# Altium schematic sheet 0240_GPU GDDR DEVICE DE.SchDoc
size 848 x 558 mm
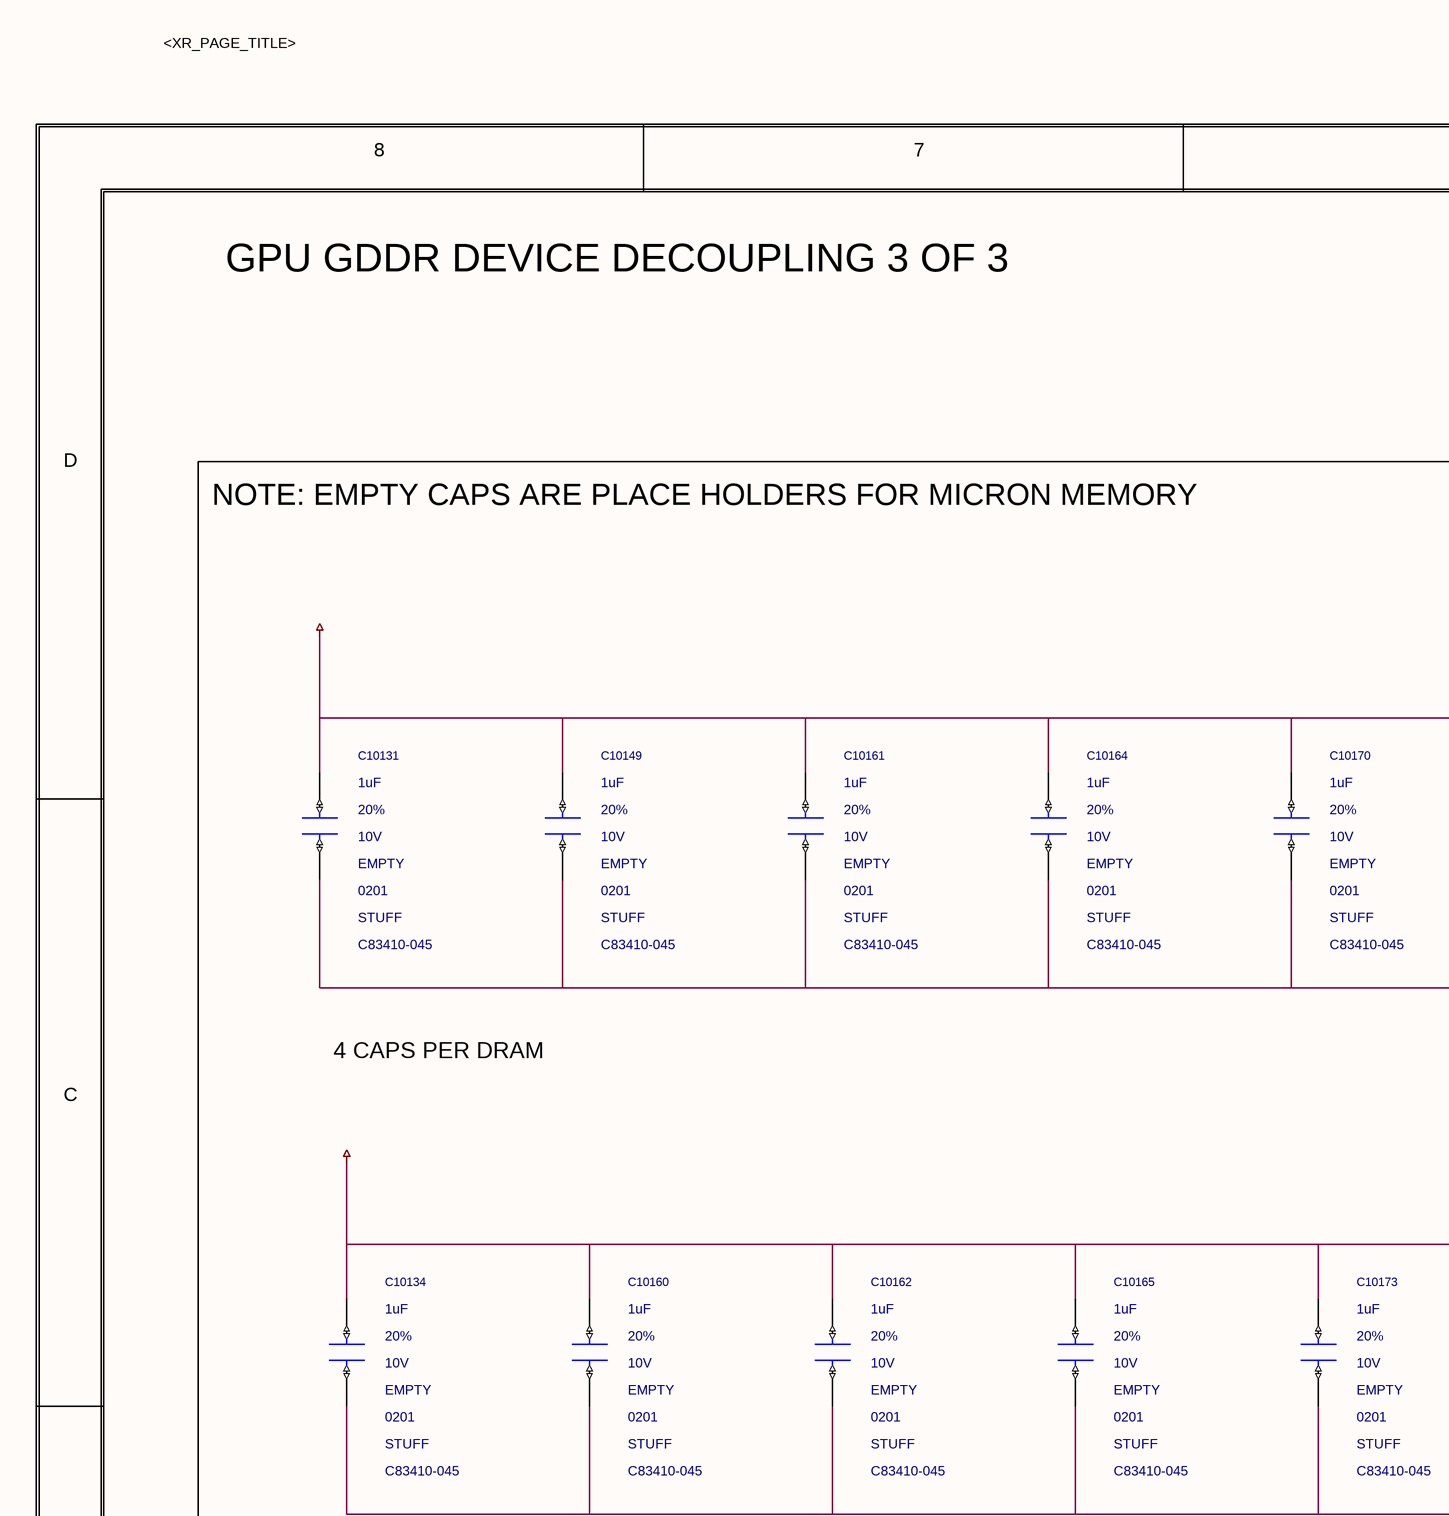
[diagram p0: 0240_GPU GDDR DEVICE DE.SchDoc, top left]
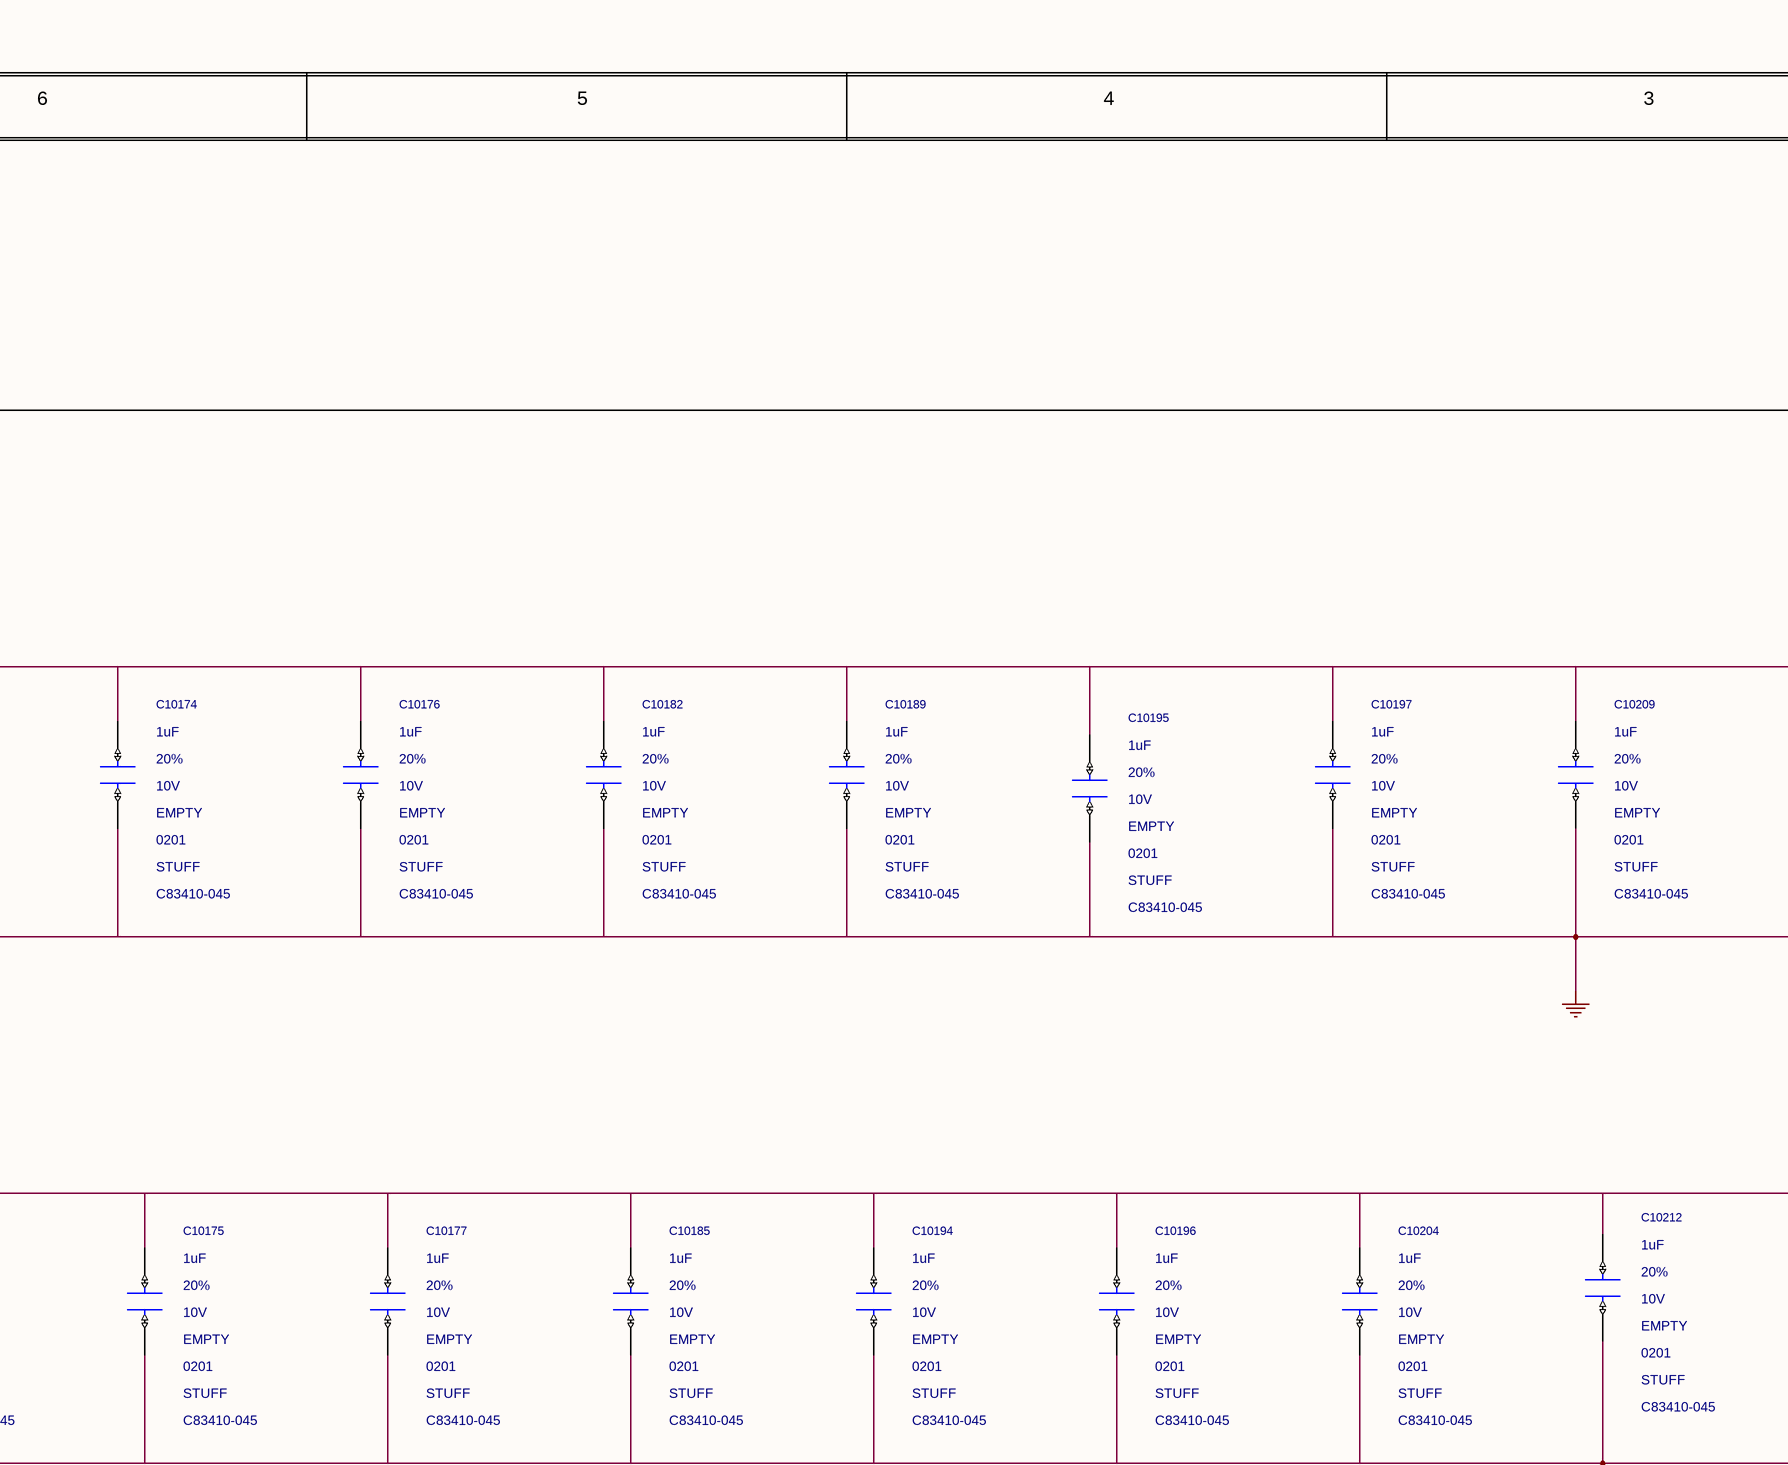
[diagram p1: 0240_GPU GDDR DEVICE DE.SchDoc, top middle]
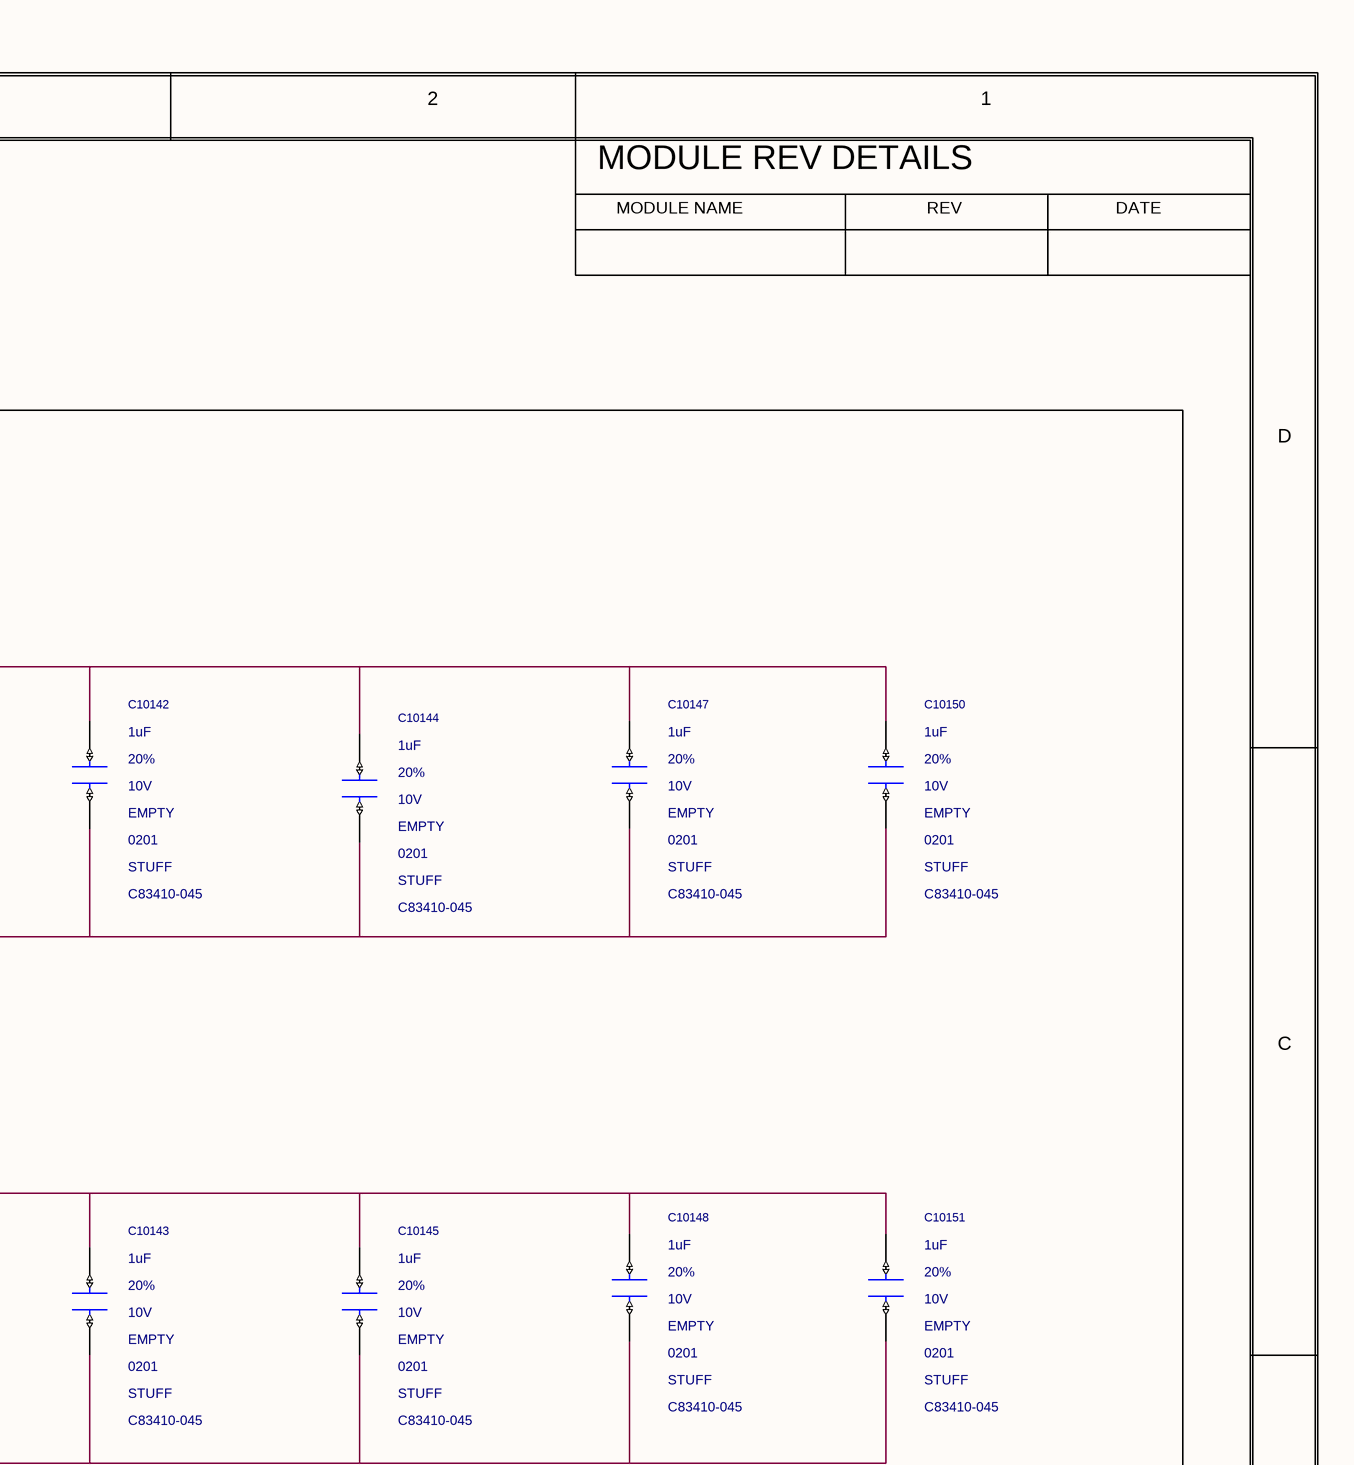
[diagram p2: 0240_GPU GDDR DEVICE DE.SchDoc, top right]
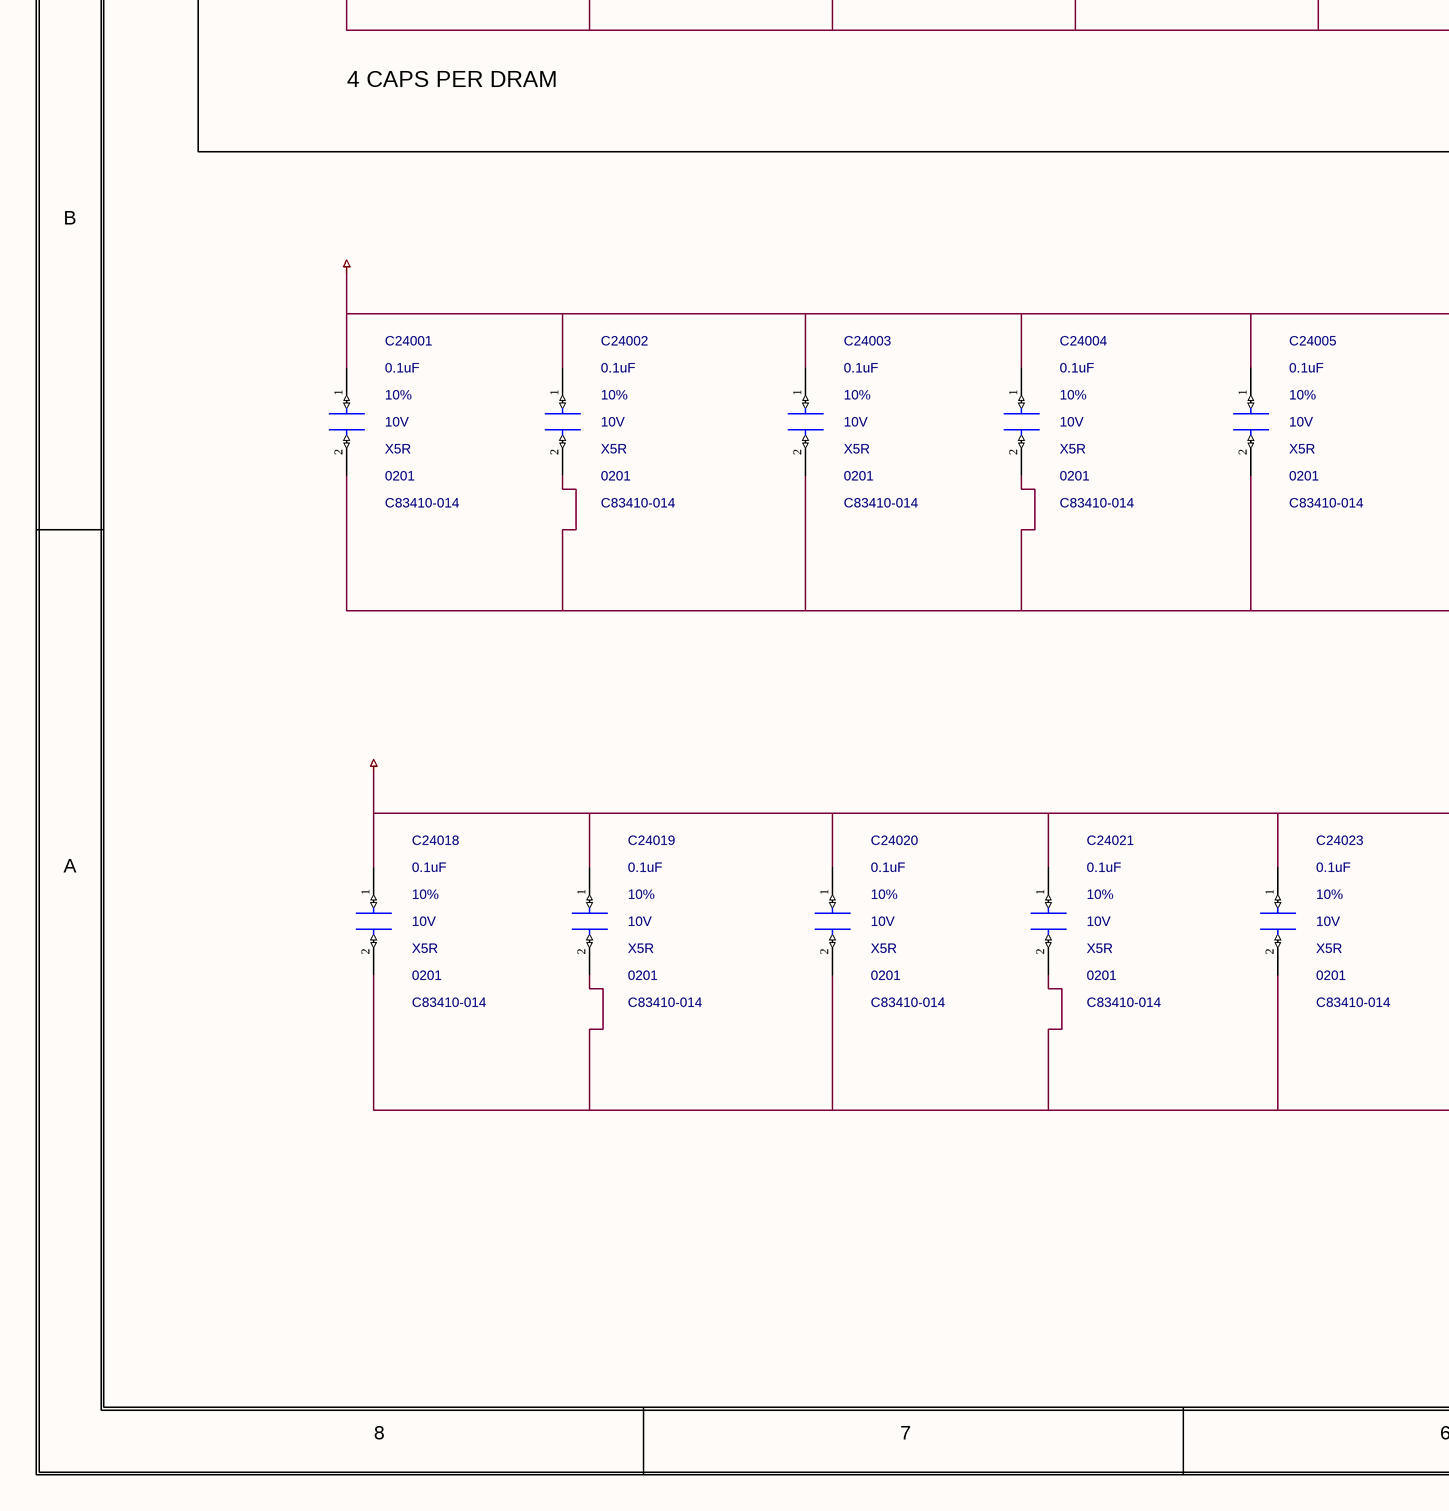
[diagram p3: 0240_GPU GDDR DEVICE DE.SchDoc, bottom left]
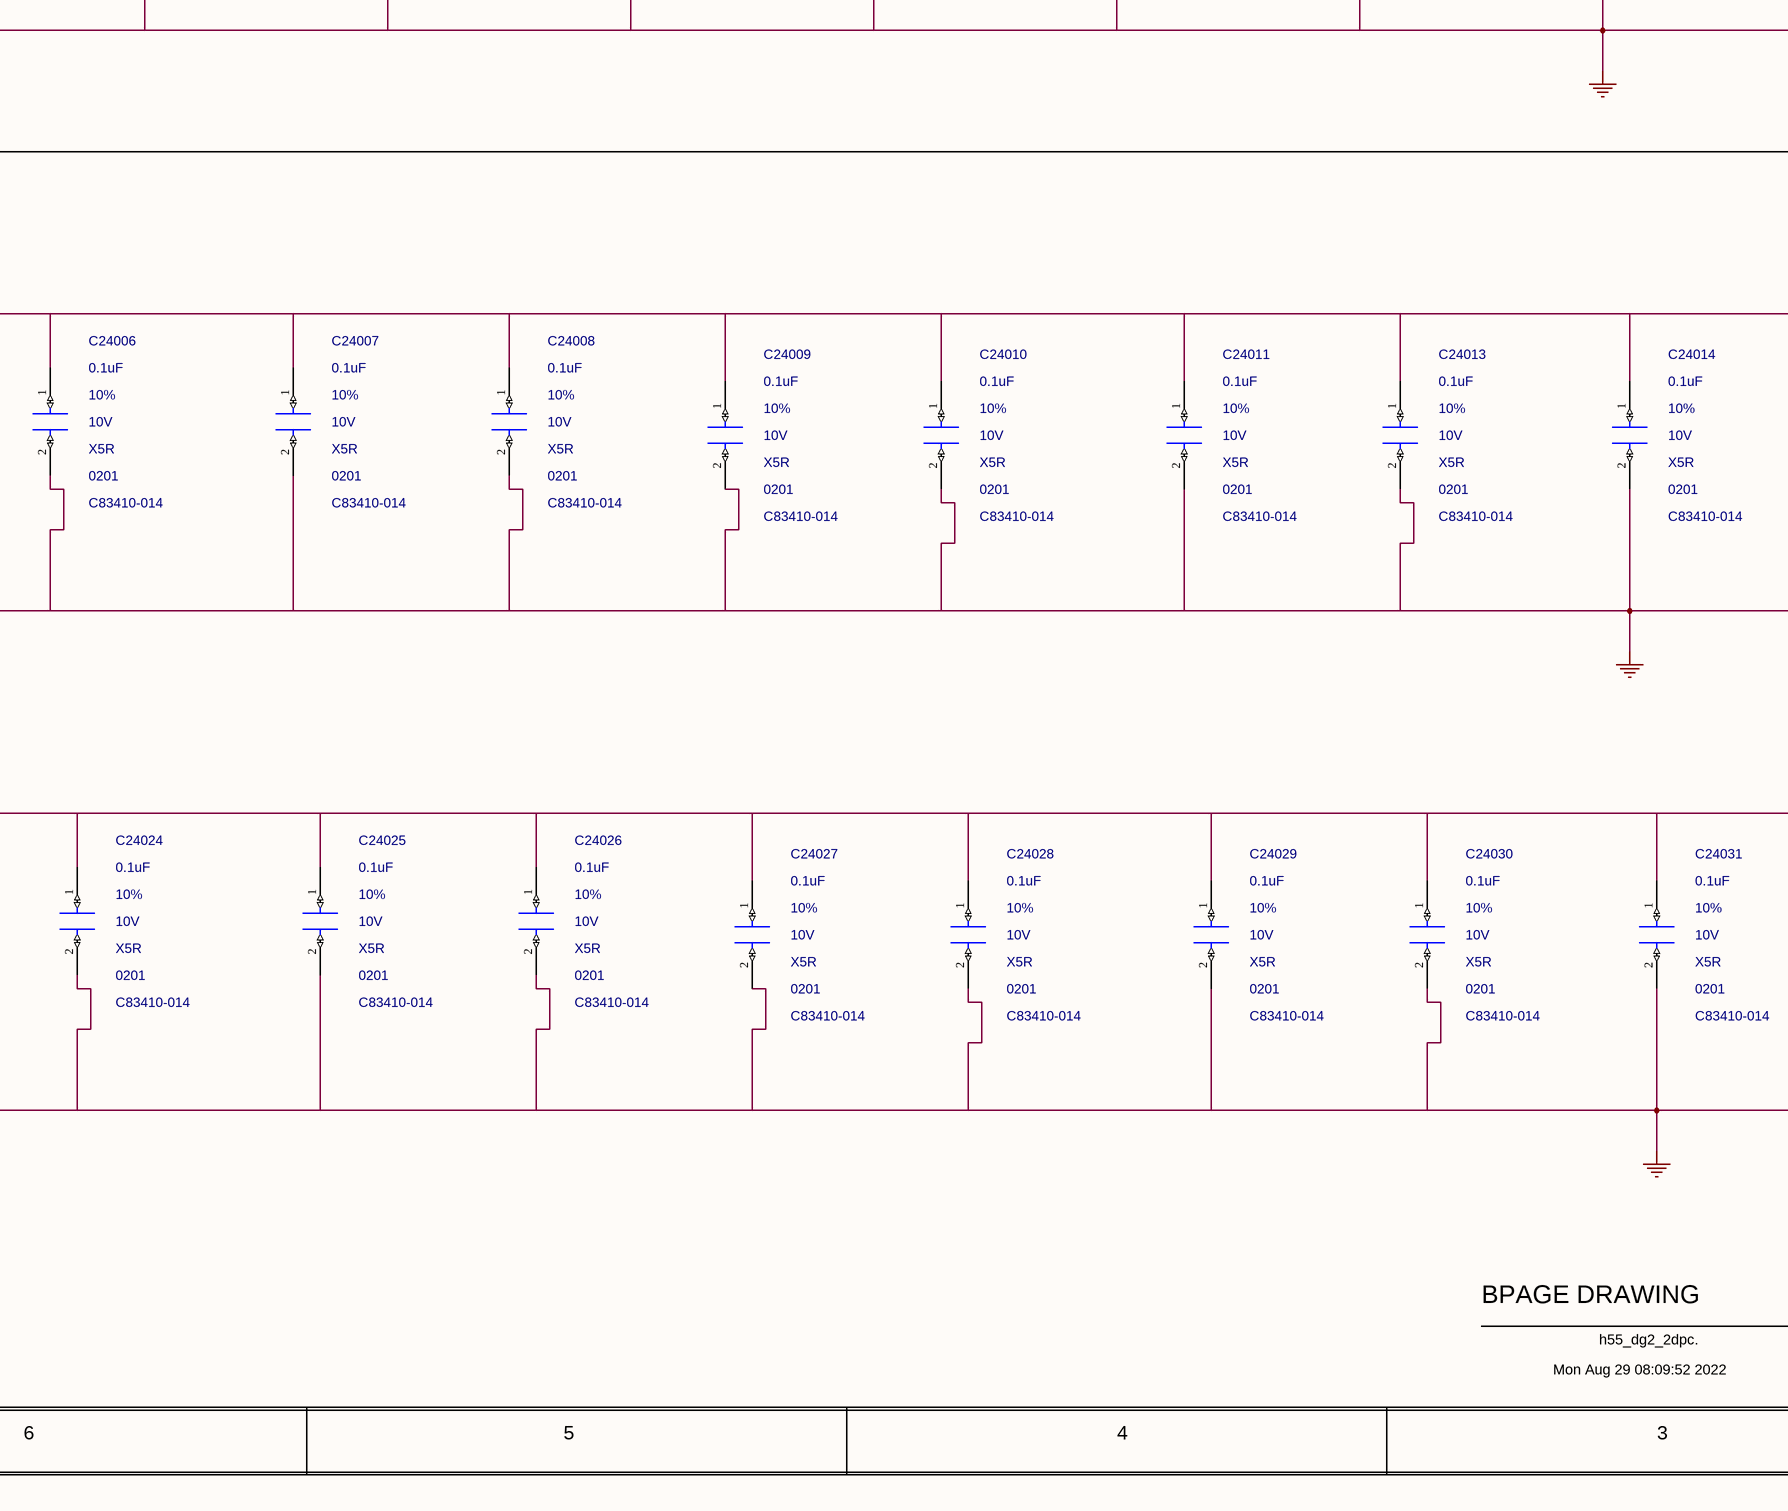
[diagram p4: 0240_GPU GDDR DEVICE DE.SchDoc, bottom middle]
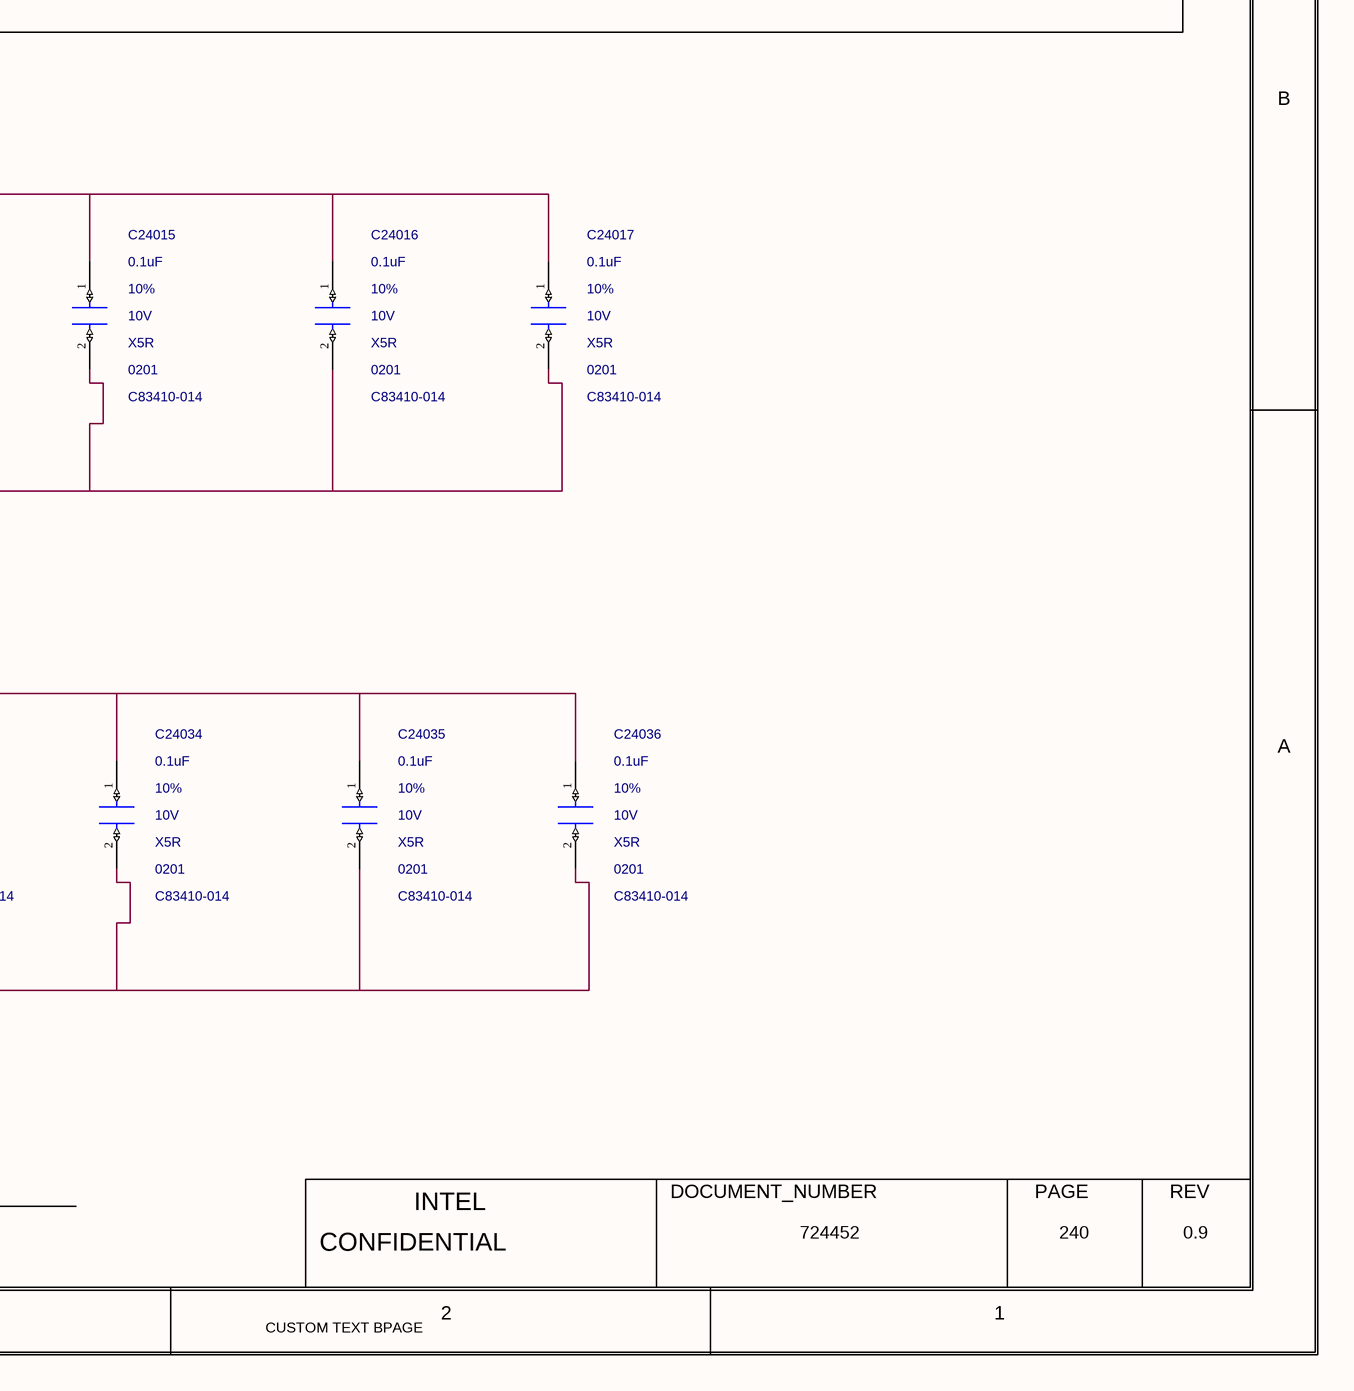
[diagram p5: 0240_GPU GDDR DEVICE DE.SchDoc, bottom right]

## Parts
C10131  1uF  BOM_USE: STUFF  MATERIAL: EMPTY  PACK_TYPE: 0201  PART_NUMBER: C83410-045  TOLERANCE: 20%  VOLTAGE: 10V  [TK0_SM0201_690X390_MA]
C10134  1uF  BOM_USE: STUFF  MATERIAL: EMPTY  PACK_TYPE: 0201  PART_NUMBER: C83410-045  TOLERANCE: 20%  VOLTAGE: 10V  [TK0_SM0201_690X390_MA]
C10142  1uF  BOM_USE: STUFF  MATERIAL: EMPTY  PACK_TYPE: 0201  PART_NUMBER: C83410-045  TOLERANCE: 20%  VOLTAGE: 10V  [TK0_SM0201_690X390_MA]
C10143  1uF  BOM_USE: STUFF  MATERIAL: EMPTY  PACK_TYPE: 0201  PART_NUMBER: C83410-045  TOLERANCE: 20%  VOLTAGE: 10V  [TK0_SM0201_690X390_MA]
C10144  1uF  BOM_USE: STUFF  MATERIAL: EMPTY  PACK_TYPE: 0201  PART_NUMBER: C83410-045  TOLERANCE: 20%  VOLTAGE: 10V  [TK0_SM0201_690X390_MA]
C10145  1uF  BOM_USE: STUFF  MATERIAL: EMPTY  PACK_TYPE: 0201  PART_NUMBER: C83410-045  TOLERANCE: 20%  VOLTAGE: 10V  [TK0_SM0201_690X390_MA]
C10147  1uF  BOM_USE: STUFF  MATERIAL: EMPTY  PACK_TYPE: 0201  PART_NUMBER: C83410-045  TOLERANCE: 20%  VOLTAGE: 10V  [TK0_SM0201_690X390_MA]
C10148  1uF  BOM_USE: STUFF  MATERIAL: EMPTY  PACK_TYPE: 0201  PART_NUMBER: C83410-045  TOLERANCE: 20%  VOLTAGE: 10V  [TK0_SM0201_690X390_MA]
C10149  1uF  BOM_USE: STUFF  MATERIAL: EMPTY  PACK_TYPE: 0201  PART_NUMBER: C83410-045  TOLERANCE: 20%  VOLTAGE: 10V  [TK0_SM0201_690X390_MA]
C10150  1uF  BOM_USE: STUFF  MATERIAL: EMPTY  PACK_TYPE: 0201  PART_NUMBER: C83410-045  TOLERANCE: 20%  VOLTAGE: 10V  [TK0_SM0201_690X390_MA]
C10151  1uF  BOM_USE: STUFF  MATERIAL: EMPTY  PACK_TYPE: 0201  PART_NUMBER: C83410-045  TOLERANCE: 20%  VOLTAGE: 10V  [TK0_SM0201_690X390_MA]
C10160  1uF  BOM_USE: STUFF  MATERIAL: EMPTY  PACK_TYPE: 0201  PART_NUMBER: C83410-045  TOLERANCE: 20%  VOLTAGE: 10V  [TK0_SM0201_690X390_MA]
C10161  1uF  BOM_USE: STUFF  MATERIAL: EMPTY  PACK_TYPE: 0201  PART_NUMBER: C83410-045  TOLERANCE: 20%  VOLTAGE: 10V  [TK0_SM0201_690X390_MA]
C10162  1uF  BOM_USE: STUFF  MATERIAL: EMPTY  PACK_TYPE: 0201  PART_NUMBER: C83410-045  TOLERANCE: 20%  VOLTAGE: 10V  [TK0_SM0201_690X390_MA]
C10164  1uF  BOM_USE: STUFF  MATERIAL: EMPTY  PACK_TYPE: 0201  PART_NUMBER: C83410-045  TOLERANCE: 20%  VOLTAGE: 10V  [TK0_SM0201_690X390_MA]
C10165  1uF  BOM_USE: STUFF  MATERIAL: EMPTY  PACK_TYPE: 0201  PART_NUMBER: C83410-045  TOLERANCE: 20%  VOLTAGE: 10V  [TK0_SM0201_690X390_MA]
C10170  1uF  BOM_USE: STUFF  MATERIAL: EMPTY  PACK_TYPE: 0201  PART_NUMBER: C83410-045  TOLERANCE: 20%  VOLTAGE: 10V  [TK0_SM0201_690X390_MA]
C10173  1uF  BOM_USE: STUFF  MATERIAL: EMPTY  PACK_TYPE: 0201  PART_NUMBER: C83410-045  TOLERANCE: 20%  VOLTAGE: 10V  [TK0_SM0201_690X390_MA]
C10174  1uF  BOM_USE: STUFF  MATERIAL: EMPTY  PACK_TYPE: 0201  PART_NUMBER: C83410-045  TOLERANCE: 20%  VOLTAGE: 10V  [TK0_SM0201_690X390_MA]
C10175  1uF  BOM_USE: STUFF  MATERIAL: EMPTY  PACK_TYPE: 0201  PART_NUMBER: C83410-045  TOLERANCE: 20%  VOLTAGE: 10V  [TK0_SM0201_690X390_MA]
C10176  1uF  BOM_USE: STUFF  MATERIAL: EMPTY  PACK_TYPE: 0201  PART_NUMBER: C83410-045  TOLERANCE: 20%  VOLTAGE: 10V  [TK0_SM0201_690X390_MA]
C10177  1uF  BOM_USE: STUFF  MATERIAL: EMPTY  PACK_TYPE: 0201  PART_NUMBER: C83410-045  TOLERANCE: 20%  VOLTAGE: 10V  [TK0_SM0201_690X390_MA]
C10182  1uF  BOM_USE: STUFF  MATERIAL: EMPTY  PACK_TYPE: 0201  PART_NUMBER: C83410-045  TOLERANCE: 20%  VOLTAGE: 10V  [TK0_SM0201_690X390_MA]
C10185  1uF  BOM_USE: STUFF  MATERIAL: EMPTY  PACK_TYPE: 0201  PART_NUMBER: C83410-045  TOLERANCE: 20%  VOLTAGE: 10V  [TK0_SM0201_690X390_MA]
C10189  1uF  BOM_USE: STUFF  MATERIAL: EMPTY  PACK_TYPE: 0201  PART_NUMBER: C83410-045  TOLERANCE: 20%  VOLTAGE: 10V  [TK0_SM0201_690X390_MA]
C10194  1uF  BOM_USE: STUFF  MATERIAL: EMPTY  PACK_TYPE: 0201  PART_NUMBER: C83410-045  TOLERANCE: 20%  VOLTAGE: 10V  [TK0_SM0201_690X390_MA]
C10195  1uF  BOM_USE: STUFF  MATERIAL: EMPTY  PACK_TYPE: 0201  PART_NUMBER: C83410-045  TOLERANCE: 20%  VOLTAGE: 10V  [TK0_SM0201_690X390_MA]
C10196  1uF  BOM_USE: STUFF  MATERIAL: EMPTY  PACK_TYPE: 0201  PART_NUMBER: C83410-045  TOLERANCE: 20%  VOLTAGE: 10V  [TK0_SM0201_690X390_MA]
C10197  1uF  BOM_USE: STUFF  MATERIAL: EMPTY  PACK_TYPE: 0201  PART_NUMBER: C83410-045  TOLERANCE: 20%  VOLTAGE: 10V  [TK0_SM0201_690X390_MA]
C10204  1uF  BOM_USE: STUFF  MATERIAL: EMPTY  PACK_TYPE: 0201  PART_NUMBER: C83410-045  TOLERANCE: 20%  VOLTAGE: 10V  [TK0_SM0201_690X390_MA]
C10209  1uF  BOM_USE: STUFF  MATERIAL: EMPTY  PACK_TYPE: 0201  PART_NUMBER: C83410-045  TOLERANCE: 20%  VOLTAGE: 10V  [TK0_SM0201_690X390_MA]
C10212  1uF  BOM_USE: STUFF  MATERIAL: EMPTY  PACK_TYPE: 0201  PART_NUMBER: C83410-045  TOLERANCE: 20%  VOLTAGE: 10V  [TK0_SM0201_690X390_MA]
C24001  0.1uF  MATERIAL: X5R  PACK_TYPE: 0201  PART_NUMBER: C83410-014  TOLERANCE: 10%  VOLTAGE: 10V  [SMC0201IA]
C24002  0.1uF  MATERIAL: X5R  PACK_TYPE: 0201  PART_NUMBER: C83410-014  TOLERANCE: 10%  VOLTAGE: 10V  [SMC0201IA]
C24003  0.1uF  MATERIAL: X5R  PACK_TYPE: 0201  PART_NUMBER: C83410-014  TOLERANCE: 10%  VOLTAGE: 10V  [SMC0201IA]
C24004  0.1uF  MATERIAL: X5R  PACK_TYPE: 0201  PART_NUMBER: C83410-014  TOLERANCE: 10%  VOLTAGE: 10V  [SMC0201IA]
C24005  0.1uF  MATERIAL: X5R  PACK_TYPE: 0201  PART_NUMBER: C83410-014  TOLERANCE: 10%  VOLTAGE: 10V  [SMC0201IA]
C24006  0.1uF  MATERIAL: X5R  PACK_TYPE: 0201  PART_NUMBER: C83410-014  TOLERANCE: 10%  VOLTAGE: 10V  [SMC0201IA]
C24007  0.1uF  MATERIAL: X5R  PACK_TYPE: 0201  PART_NUMBER: C83410-014  TOLERANCE: 10%  VOLTAGE: 10V  [SMC0201IA]
C24008  0.1uF  MATERIAL: X5R  PACK_TYPE: 0201  PART_NUMBER: C83410-014  TOLERANCE: 10%  VOLTAGE: 10V  [SMC0201IA]
C24009  0.1uF  MATERIAL: X5R  PACK_TYPE: 0201  PART_NUMBER: C83410-014  TOLERANCE: 10%  VOLTAGE: 10V  [SMC0201IA]
C24010  0.1uF  MATERIAL: X5R  PACK_TYPE: 0201  PART_NUMBER: C83410-014  TOLERANCE: 10%  VOLTAGE: 10V  [SMC0201IA]
C24011  0.1uF  MATERIAL: X5R  PACK_TYPE: 0201  PART_NUMBER: C83410-014  TOLERANCE: 10%  VOLTAGE: 10V  [SMC0201IA]
C24013  0.1uF  MATERIAL: X5R  PACK_TYPE: 0201  PART_NUMBER: C83410-014  TOLERANCE: 10%  VOLTAGE: 10V  [SMC0201IA]
C24014  0.1uF  MATERIAL: X5R  PACK_TYPE: 0201  PART_NUMBER: C83410-014  TOLERANCE: 10%  VOLTAGE: 10V  [SMC0201IA]
C24015  0.1uF  MATERIAL: X5R  PACK_TYPE: 0201  PART_NUMBER: C83410-014  TOLERANCE: 10%  VOLTAGE: 10V  [SMC0201IA]
C24016  0.1uF  MATERIAL: X5R  PACK_TYPE: 0201  PART_NUMBER: C83410-014  TOLERANCE: 10%  VOLTAGE: 10V  [SMC0201IA]
C24017  0.1uF  MATERIAL: X5R  PACK_TYPE: 0201  PART_NUMBER: C83410-014  TOLERANCE: 10%  VOLTAGE: 10V  [SMC0201IA]
C24018  0.1uF  MATERIAL: X5R  PACK_TYPE: 0201  PART_NUMBER: C83410-014  TOLERANCE: 10%  VOLTAGE: 10V  [SMC0201IA]
C24019  0.1uF  MATERIAL: X5R  PACK_TYPE: 0201  PART_NUMBER: C83410-014  TOLERANCE: 10%  VOLTAGE: 10V  [SMC0201IA]
C24020  0.1uF  MATERIAL: X5R  PACK_TYPE: 0201  PART_NUMBER: C83410-014  TOLERANCE: 10%  VOLTAGE: 10V  [SMC0201IA]
C24021  0.1uF  MATERIAL: X5R  PACK_TYPE: 0201  PART_NUMBER: C83410-014  TOLERANCE: 10%  VOLTAGE: 10V  [SMC0201IA]
C24023  0.1uF  MATERIAL: X5R  PACK_TYPE: 0201  PART_NUMBER: C83410-014  TOLERANCE: 10%  VOLTAGE: 10V  [SMC0201IA]
C24024  0.1uF  MATERIAL: X5R  PACK_TYPE: 0201  PART_NUMBER: C83410-014  TOLERANCE: 10%  VOLTAGE: 10V  [SMC0201IA]
C24025  0.1uF  MATERIAL: X5R  PACK_TYPE: 0201  PART_NUMBER: C83410-014  TOLERANCE: 10%  VOLTAGE: 10V  [SMC0201IA]
C24026  0.1uF  MATERIAL: X5R  PACK_TYPE: 0201  PART_NUMBER: C83410-014  TOLERANCE: 10%  VOLTAGE: 10V  [SMC0201IA]
C24027  0.1uF  MATERIAL: X5R  PACK_TYPE: 0201  PART_NUMBER: C83410-014  TOLERANCE: 10%  VOLTAGE: 10V  [SMC0201IA]
C24028  0.1uF  MATERIAL: X5R  PACK_TYPE: 0201  PART_NUMBER: C83410-014  TOLERANCE: 10%  VOLTAGE: 10V  [SMC0201IA]
C24029  0.1uF  MATERIAL: X5R  PACK_TYPE: 0201  PART_NUMBER: C83410-014  TOLERANCE: 10%  VOLTAGE: 10V  [SMC0201IA]
C24030  0.1uF  MATERIAL: X5R  PACK_TYPE: 0201  PART_NUMBER: C83410-014  TOLERANCE: 10%  VOLTAGE: 10V  [SMC0201IA]
C24031  0.1uF  MATERIAL: X5R  PACK_TYPE: 0201  PART_NUMBER: C83410-014  TOLERANCE: 10%  VOLTAGE: 10V  [SMC0201IA]
C24034  0.1uF  MATERIAL: X5R  PACK_TYPE: 0201  PART_NUMBER: C83410-014  TOLERANCE: 10%  VOLTAGE: 10V  [SMC0201IA]
C24035  0.1uF  MATERIAL: X5R  PACK_TYPE: 0201  PART_NUMBER: C83410-014  TOLERANCE: 10%  VOLTAGE: 10V  [SMC0201IA]
C24036  0.1uF  MATERIAL: X5R  PACK_TYPE: 0201  PART_NUMBER: C83410-014  TOLERANCE: 10%  VOLTAGE: 10V  [SMC0201IA]

## Blocks framed on the sheet
NOTE: EMPTY CAPS ARE PLACE HOLDERS FOR MICRON MEMORY: C10131 C10134 C10142-C10145 C10147-C10151 C10160-C10162 C10164 C10165 C10170 C10173-C10177 C10182 C10185 C10189 C10194-C10197 C10204 C10209 C10212

## Nets
+V1P8S_GPU: C24001.1(A) C24002.1(A) C24003.1(A) C24004.1(A) C24005.1(A) C24006.1(A) C24007.1(A) C24008.1(A) C24009.1(A) C24010.1(A) C24011.1(A) C24013.1(A) C24014.1(A) C24015.1(A) C24016.1(A) C24017.1(A) C24018.1(A) C24019.1(A) C24020.1(A) C24021.1(A) C24023.1(A) C24024.1(A) C24025.1(A) C24026.1(A) C24027.1(A) C24028.1(A) C24029.1(A) C24030.1(A) C24031.1(A) C24034.1(A) C24035.1(A) C24036.1(A)
+VDD_GDDR6: C10131.1(A) C10134.1(A) C10142.1(A) C10143.1(A) C10144.1(A) C10145.1(A) C10147.1(A) C10148.1(A) C10149.1(A) C10150.1(A) C10151.1(A) C10160.1(A) C10161.1(A) C10162.1(A) C10164.1(A) C10165.1(A) C10170.1(A) C10173.1(A) C10174.1(A) C10175.1(A) C10176.1(A) C10177.1(A) C10182.1(A) C10185.1(A) C10189.1(A) C10194.1(A) C10195.1(A) C10196.1(A) C10197.1(A) C10204.1(A) C10209.1(A) C10212.1(A)
GND: C10131.2(B) C10134.2(B) C10142.2(B) C10143.2(B) C10144.2(B) C10145.2(B) C10147.2(B) C10148.2(B) C10149.2(B) C10150.2(B) C10151.2(B) C10160.2(B) C10161.2(B) C10162.2(B) C10164.2(B) C10165.2(B) C10170.2(B) C10173.2(B) C10174.2(B) C10175.2(B) C10176.2(B) C10177.2(B) C10182.2(B) C10185.2(B) C10189.2(B) C10194.2(B) C10195.2(B) C10196.2(B) C10197.2(B) C10204.2(B) C10209.2(B) C10212.2(B) C24001.2(B) C24002.2(B) C24003.2(B) C24004.2(B) C24005.2(B) C24006.2(B) C24007.2(B) C24008.2(B) C24009.2(B) C24010.2(B) C24011.2(B) C24013.2(B) C24014.2(B) C24015.2(B) C24016.2(B) C24017.2(B) C24018.2(B) C24019.2(B) C24020.2(B) C24021.2(B) C24023.2(B) C24024.2(B) C24025.2(B) C24026.2(B) C24027.2(B) C24028.2(B) C24029.2(B) C24030.2(B) C24031.2(B) C24034.2(B) C24035.2(B) C24036.2(B)

## Notes on the sheet
- <XR_PAGE_TITLE>
- 8
- 7
- 6
- 5
- 4
- 3
- 2
- 1
- MODULE REV DETAILS
- GPU GDDR DEVICE DECOUPLING 3 OF 3
- MODULE NAME
- REV
- DATE
- D
- 4 CAPS PER DRAM
- C
- B
- A
- BPAGE DRAWING
- INTEL
- DOCUMENT_NUMBER
- PAGE
- Mon Aug 29 08:09:52 2022
- h55_dg2_2dpc.
- CONFIDENTIAL
- 724452
- 240
- 0.9
- CUSTOM TEXT BPAGE

## Library data of the parts
C10131 = CAP_2: CDS_PHYS_PART_NAME: CAP_2_0201-C83410-045,EMPTY,1UF,10V,20%,TK0,GENERIC; CDS_LMAN_SYM_OUTLINE: -50,50,50,-50; FP_TECH: TK0; IP: GENERIC; ROOM: NONE; OriginalSymbolOrigin: (-50,25); XY: (-7600,3825); VER: 1; ROT: 0; PHYS_PAGE: 240; LOCATION: C10131; DRAWING: @RVP1_ADL_SB_ADP_S_DDR5_SODIMM_2DPC_LIB.H55_DG2_2DPC(SCH_1):PAGE411; CDS_LIB: discrete_2; VARIANT: ?; PCB Footprint: TK0_SM0201_690X390_MA; CHIPS_PART_NAME: CAP_2; CDS_PART_NAME: CAP_2_0201-C83410-045,EMPTY,1UF,10V,20%,TK0,GENERIC; CDS_LOCATION: C10131
C10134 = CAP_2: CDS_PHYS_PART_NAME: CAP_2_0201-C83410-045,EMPTY,1UF,10V,20%,TK0,GENERIC; CDS_LMAN_SYM_OUTLINE: -50,50,50,-50; FP_TECH: TK0; IP: GENERIC; ROOM: NONE; OriginalSymbolOrigin: (-50,25); XY: (-7550,2850); VER: 1; ROT: 0; PHYS_PAGE: 240; LOCATION: C10134; DRAWING: @RVP1_ADL_SB_ADP_S_DDR5_SODIMM_2DPC_LIB.H55_DG2_2DPC(SCH_1):PAGE411; CDS_LIB: discrete_2; VARIANT: ?; PCB Footprint: TK0_SM0201_690X390_MA; CHIPS_PART_NAME: CAP_2; CDS_PART_NAME: CAP_2_0201-C83410-045,EMPTY,1UF,10V,20%,TK0,GENERIC; CDS_LOCATION: C10134
C10142 = CAP_2: CDS_PHYS_PART_NAME: CAP_2_0201-C83410-045,EMPTY,1UF,10V,20%,TK0,GENERIC; CDS_LMAN_SYM_OUTLINE: -50,50,50,-50; FP_TECH: TK0; IP: GENERIC; ROOM: NONE; OriginalSymbolOrigin: (-50,25); XY: (-2150,3825); VER: 1; ROT: 0; PHYS_PAGE: 240; LOCATION: C10142; DRAWING: @RVP1_ADL_SB_ADP_S_DDR5_SODIMM_2DPC_LIB.H55_DG2_2DPC(SCH_1):PAGE411; CDS_LIB: discrete_2; VARIANT: ?; PCB Footprint: TK0_SM0201_690X390_MA; CHIPS_PART_NAME: CAP_2; CDS_PART_NAME: CAP_2_0201-C83410-045,EMPTY,1UF,10V,20%,TK0,GENERIC; CDS_LOCATION: C10142
C10143 = CAP_2: CDS_PHYS_PART_NAME: CAP_2_0201-C83410-045,EMPTY,1UF,10V,20%,TK0,GENERIC; CDS_LMAN_SYM_OUTLINE: -50,50,50,-50; FP_TECH: TK0; IP: GENERIC; ROOM: NONE; OriginalSymbolOrigin: (-50,25); XY: (-2150,2850); VER: 1; ROT: 0; PHYS_PAGE: 240; LOCATION: C10143; DRAWING: @RVP1_ADL_SB_ADP_S_DDR5_SODIMM_2DPC_LIB.H55_DG2_2DPC(SCH_1):PAGE411; CDS_LIB: discrete_2; VARIANT: ?; PCB Footprint: TK0_SM0201_690X390_MA; CHIPS_PART_NAME: CAP_2; CDS_PART_NAME: CAP_2_0201-C83410-045,EMPTY,1UF,10V,20%,TK0,GENERIC; CDS_LOCATION: C10143
C10144 = CAP_2: CDS_PHYS_PART_NAME: CAP_2_0201-C83410-045,EMPTY,1UF,10V,20%,TK0,GENERIC; CDS_LMAN_SYM_OUTLINE: -50,50,50,-50; FP_TECH: TK0; IP: GENERIC; ROOM: NONE; OriginalSymbolOrigin: (-50,25); XY: (-1650,3800); VER: 1; ROT: 0; PHYS_PAGE: 240; LOCATION: C10144; DRAWING: @RVP1_ADL_SB_ADP_S_DDR5_SODIMM_2DPC_LIB.H55_DG2_2DPC(SCH_1):PAGE411; CDS_LIB: discrete_2; VARIANT: ?; PCB Footprint: TK0_SM0201_690X390_MA; CHIPS_PART_NAME: CAP_2; CDS_PART_NAME: CAP_2_0201-C83410-045,EMPTY,1UF,10V,20%,TK0,GENERIC; CDS_LOCATION: C10144
C10145 = CAP_2: CDS_PHYS_PART_NAME: CAP_2_0201-C83410-045,EMPTY,1UF,10V,20%,TK0,GENERIC; CDS_LMAN_SYM_OUTLINE: -50,50,50,-50; FP_TECH: TK0; IP: GENERIC; ROOM: NONE; OriginalSymbolOrigin: (-50,25); XY: (-1650,2850); VER: 1; ROT: 0; PHYS_PAGE: 240; LOCATION: C10145; DRAWING: @RVP1_ADL_SB_ADP_S_DDR5_SODIMM_2DPC_LIB.H55_DG2_2DPC(SCH_1):PAGE411; CDS_LIB: discrete_2; VARIANT: ?; PCB Footprint: TK0_SM0201_690X390_MA; CHIPS_PART_NAME: CAP_2; CDS_PART_NAME: CAP_2_0201-C83410-045,EMPTY,1UF,10V,20%,TK0,GENERIC; CDS_LOCATION: C10145
C10147 = CAP_2: CDS_PHYS_PART_NAME: CAP_2_0201-C83410-045,EMPTY,1UF,10V,20%,TK0,GENERIC; CDS_LMAN_SYM_OUTLINE: -50,50,50,-50; FP_TECH: TK0; IP: GENERIC; ROOM: NONE; OriginalSymbolOrigin: (-50,25); XY: (-1150,3825); VER: 1; ROT: 0; PHYS_PAGE: 240; LOCATION: C10147; DRAWING: @RVP1_ADL_SB_ADP_S_DDR5_SODIMM_2DPC_LIB.H55_DG2_2DPC(SCH_1):PAGE411; CDS_LIB: discrete_2; VARIANT: ?; PCB Footprint: TK0_SM0201_690X390_MA; CHIPS_PART_NAME: CAP_2; CDS_PART_NAME: CAP_2_0201-C83410-045,EMPTY,1UF,10V,20%,TK0,GENERIC; CDS_LOCATION: C10147
C10148 = CAP_2: CDS_PHYS_PART_NAME: CAP_2_0201-C83410-045,EMPTY,1UF,10V,20%,TK0,GENERIC; CDS_LMAN_SYM_OUTLINE: -50,50,50,-50; FP_TECH: TK0; IP: GENERIC; ROOM: NONE; OriginalSymbolOrigin: (-50,25); XY: (-1150,2875); VER: 1; ROT: 0; PHYS_PAGE: 240; LOCATION: C10148; DRAWING: @RVP1_ADL_SB_ADP_S_DDR5_SODIMM_2DPC_LIB.H55_DG2_2DPC(SCH_1):PAGE411; CDS_LIB: discrete_2; VARIANT: ?; PCB Footprint: TK0_SM0201_690X390_MA; CHIPS_PART_NAME: CAP_2; CDS_PART_NAME: CAP_2_0201-C83410-045,EMPTY,1UF,10V,20%,TK0,GENERIC; CDS_LOCATION: C10148
C10149 = CAP_2: CDS_PHYS_PART_NAME: CAP_2_0201-C83410-045,EMPTY,1UF,10V,20%,TK0,GENERIC; CDS_LMAN_SYM_OUTLINE: -50,50,50,-50; FP_TECH: TK0; IP: GENERIC; ROOM: NONE; OriginalSymbolOrigin: (-50,25); XY: (-7150,3825); VER: 1; ROT: 0; PHYS_PAGE: 240; LOCATION: C10149; DRAWING: @RVP1_ADL_SB_ADP_S_DDR5_SODIMM_2DPC_LIB.H55_DG2_2DPC(SCH_1):PAGE411; CDS_LIB: discrete_2; VARIANT: ?; PCB Footprint: TK0_SM0201_690X390_MA; CHIPS_PART_NAME: CAP_2; CDS_PART_NAME: CAP_2_0201-C83410-045,EMPTY,1UF,10V,20%,TK0,GENERIC; CDS_LOCATION: C10149
C10150 = CAP_2: CDS_PHYS_PART_NAME: CAP_2_0201-C83410-045,EMPTY,1UF,10V,20%,TK0,GENERIC; CDS_LMAN_SYM_OUTLINE: -50,50,50,-50; FP_TECH: TK0; IP: GENERIC; ROOM: NONE; OriginalSymbolOrigin: (-50,25); XY: (-675,3825); VER: 1; ROT: 0; PHYS_PAGE: 240; LOCATION: C10150; DRAWING: @RVP1_ADL_SB_ADP_S_DDR5_SODIMM_2DPC_LIB.H55_DG2_2DPC(SCH_1):PAGE411; CDS_LIB: discrete_2; VARIANT: ?; PCB Footprint: TK0_SM0201_690X390_MA; CHIPS_PART_NAME: CAP_2; CDS_PART_NAME: CAP_2_0201-C83410-045,EMPTY,1UF,10V,20%,TK0,GENERIC; CDS_LOCATION: C10150
C10151 = CAP_2: CDS_PHYS_PART_NAME: CAP_2_0201-C83410-045,EMPTY,1UF,10V,20%,TK0,GENERIC; CDS_LMAN_SYM_OUTLINE: -50,50,50,-50; FP_TECH: TK0; IP: GENERIC; ROOM: NONE; OriginalSymbolOrigin: (-50,25); XY: (-675,2875); VER: 1; ROT: 0; PHYS_PAGE: 240; LOCATION: C10151; DRAWING: @RVP1_ADL_SB_ADP_S_DDR5_SODIMM_2DPC_LIB.H55_DG2_2DPC(SCH_1):PAGE411; CDS_LIB: discrete_2; VARIANT: ?; PCB Footprint: TK0_SM0201_690X390_MA; CHIPS_PART_NAME: CAP_2; CDS_PART_NAME: CAP_2_0201-C83410-045,EMPTY,1UF,10V,20%,TK0,GENERIC; CDS_LOCATION: C10151
C10160 = CAP_2: CDS_PHYS_PART_NAME: CAP_2_0201-C83410-045,EMPTY,1UF,10V,20%,TK0,GENERIC; CDS_LMAN_SYM_OUTLINE: -50,50,50,-50; FP_TECH: TK0; IP: GENERIC; ROOM: NONE; OriginalSymbolOrigin: (-50,25); XY: (-7100,2850); VER: 1; ROT: 0; PHYS_PAGE: 240; LOCATION: C10160; DRAWING: @RVP1_ADL_SB_ADP_S_DDR5_SODIMM_2DPC_LIB.H55_DG2_2DPC(SCH_1):PAGE411; CDS_LIB: discrete_2; VARIANT: ?; PCB Footprint: TK0_SM0201_690X390_MA; CHIPS_PART_NAME: CAP_2; CDS_PART_NAME: CAP_2_0201-C83410-045,EMPTY,1UF,10V,20%,TK0,GENERIC; CDS_LOCATION: C10160
C10161 = CAP_2: CDS_PHYS_PART_NAME: CAP_2_0201-C83410-045,EMPTY,1UF,10V,20%,TK0,GENERIC; CDS_LMAN_SYM_OUTLINE: -50,50,50,-50; FP_TECH: TK0; IP: GENERIC; ROOM: NONE; OriginalSymbolOrigin: (-50,25); XY: (-6700,3825); VER: 1; ROT: 0; PHYS_PAGE: 240; LOCATION: C10161; DRAWING: @RVP1_ADL_SB_ADP_S_DDR5_SODIMM_2DPC_LIB.H55_DG2_2DPC(SCH_1):PAGE411; CDS_LIB: discrete_2; VARIANT: ?; PCB Footprint: TK0_SM0201_690X390_MA; CHIPS_PART_NAME: CAP_2; CDS_PART_NAME: CAP_2_0201-C83410-045,EMPTY,1UF,10V,20%,TK0,GENERIC; CDS_LOCATION: C10161
C10162 = CAP_2: CDS_PHYS_PART_NAME: CAP_2_0201-C83410-045,EMPTY,1UF,10V,20%,TK0,GENERIC; CDS_LMAN_SYM_OUTLINE: -50,50,50,-50; FP_TECH: TK0; IP: GENERIC; ROOM: NONE; OriginalSymbolOrigin: (-50,25); XY: (-6650,2850); VER: 1; ROT: 0; PHYS_PAGE: 240; LOCATION: C10162; DRAWING: @RVP1_ADL_SB_ADP_S_DDR5_SODIMM_2DPC_LIB.H55_DG2_2DPC(SCH_1):PAGE411; CDS_LIB: discrete_2; VARIANT: ?; PCB Footprint: TK0_SM0201_690X390_MA; CHIPS_PART_NAME: CAP_2; CDS_PART_NAME: CAP_2_0201-C83410-045,EMPTY,1UF,10V,20%,TK0,GENERIC; CDS_LOCATION: C10162
C10164 = CAP_2: CDS_PHYS_PART_NAME: CAP_2_0201-C83410-045,EMPTY,1UF,10V,20%,TK0,GENERIC; CDS_LMAN_SYM_OUTLINE: -50,50,50,-50; FP_TECH: TK0; IP: GENERIC; ROOM: NONE; OriginalSymbolOrigin: (-50,25); XY: (-6250,3825); VER: 1; ROT: 0; PHYS_PAGE: 240; LOCATION: C10164; DRAWING: @RVP1_ADL_SB_ADP_S_DDR5_SODIMM_2DPC_LIB.H55_DG2_2DPC(SCH_1):PAGE411; CDS_LIB: discrete_2; VARIANT: ?; PCB Footprint: TK0_SM0201_690X390_MA; CHIPS_PART_NAME: CAP_2; CDS_PART_NAME: CAP_2_0201-C83410-045,EMPTY,1UF,10V,20%,TK0,GENERIC; CDS_LOCATION: C10164
C10165 = CAP_2: CDS_PHYS_PART_NAME: CAP_2_0201-C83410-045,EMPTY,1UF,10V,20%,TK0,GENERIC; CDS_LMAN_SYM_OUTLINE: -50,50,50,-50; FP_TECH: TK0; IP: GENERIC; ROOM: NONE; OriginalSymbolOrigin: (-50,25); XY: (-6200,2850); VER: 1; ROT: 0; PHYS_PAGE: 240; LOCATION: C10165; DRAWING: @RVP1_ADL_SB_ADP_S_DDR5_SODIMM_2DPC_LIB.H55_DG2_2DPC(SCH_1):PAGE411; CDS_LIB: discrete_2; VARIANT: ?; PCB Footprint: TK0_SM0201_690X390_MA; CHIPS_PART_NAME: CAP_2; CDS_PART_NAME: CAP_2_0201-C83410-045,EMPTY,1UF,10V,20%,TK0,GENERIC; CDS_LOCATION: C10165
C10170 = CAP_2: CDS_PHYS_PART_NAME: CAP_2_0201-C83410-045,EMPTY,1UF,10V,20%,TK0,GENERIC; CDS_LMAN_SYM_OUTLINE: -50,50,50,-50; FP_TECH: TK0; IP: GENERIC; ROOM: NONE; OriginalSymbolOrigin: (-50,25); XY: (-5800,3825); VER: 1; ROT: 0; PHYS_PAGE: 240; LOCATION: C10170; DRAWING: @RVP1_ADL_SB_ADP_S_DDR5_SODIMM_2DPC_LIB.H55_DG2_2DPC(SCH_1):PAGE411; CDS_LIB: discrete_2; VARIANT: ?; PCB Footprint: TK0_SM0201_690X390_MA; CHIPS_PART_NAME: CAP_2; CDS_PART_NAME: CAP_2_0201-C83410-045,EMPTY,1UF,10V,20%,TK0,GENERIC; CDS_LOCATION: C10170
C10173 = CAP_2: CDS_PHYS_PART_NAME: CAP_2_0201-C83410-045,EMPTY,1UF,10V,20%,TK0,GENERIC; CDS_LMAN_SYM_OUTLINE: -50,50,50,-50; FP_TECH: TK0; IP: GENERIC; ROOM: NONE; OriginalSymbolOrigin: (-50,25); XY: (-5750,2850); VER: 1; ROT: 0; PHYS_PAGE: 240; LOCATION: C10173; DRAWING: @RVP1_ADL_SB_ADP_S_DDR5_SODIMM_2DPC_LIB.H55_DG2_2DPC(SCH_1):PAGE411; CDS_LIB: discrete_2; VARIANT: ?; PCB Footprint: TK0_SM0201_690X390_MA; CHIPS_PART_NAME: CAP_2; CDS_PART_NAME: CAP_2_0201-C83410-045,EMPTY,1UF,10V,20%,TK0,GENERIC; CDS_LOCATION: C10173
C10174 = CAP_2: CDS_PHYS_PART_NAME: CAP_2_0201-C83410-045,EMPTY,1UF,10V,20%,TK0,GENERIC; CDS_LMAN_SYM_OUTLINE: -50,50,50,-50; FP_TECH: TK0; IP: GENERIC; ROOM: NONE; OriginalSymbolOrigin: (-50,25); XY: (-5350,3825); VER: 1; ROT: 0; PHYS_PAGE: 240; LOCATION: C10174; DRAWING: @RVP1_ADL_SB_ADP_S_DDR5_SODIMM_2DPC_LIB.H55_DG2_2DPC(SCH_1):PAGE411; CDS_LIB: discrete_2; VARIANT: ?; PCB Footprint: TK0_SM0201_690X390_MA; CHIPS_PART_NAME: CAP_2; CDS_PART_NAME: CAP_2_0201-C83410-045,EMPTY,1UF,10V,20%,TK0,GENERIC; CDS_LOCATION: C10174
C10175 = CAP_2: CDS_PHYS_PART_NAME: CAP_2_0201-C83410-045,EMPTY,1UF,10V,20%,TK0,GENERIC; CDS_LMAN_SYM_OUTLINE: -50,50,50,-50; FP_TECH: TK0; IP: GENERIC; ROOM: NONE; OriginalSymbolOrigin: (-50,25); XY: (-5300,2850); VER: 1; ROT: 0; PHYS_PAGE: 240; LOCATION: C10175; DRAWING: @RVP1_ADL_SB_ADP_S_DDR5_SODIMM_2DPC_LIB.H55_DG2_2DPC(SCH_1):PAGE411; CDS_LIB: discrete_2; VARIANT: ?; PCB Footprint: TK0_SM0201_690X390_MA; CHIPS_PART_NAME: CAP_2; CDS_PART_NAME: CAP_2_0201-C83410-045,EMPTY,1UF,10V,20%,TK0,GENERIC; CDS_LOCATION: C10175
C10176 = CAP_2: CDS_PHYS_PART_NAME: CAP_2_0201-C83410-045,EMPTY,1UF,10V,20%,TK0,GENERIC; CDS_LMAN_SYM_OUTLINE: -50,50,50,-50; FP_TECH: TK0; IP: GENERIC; ROOM: NONE; OriginalSymbolOrigin: (-50,25); XY: (-4900,3825); VER: 1; ROT: 0; PHYS_PAGE: 240; LOCATION: C10176; DRAWING: @RVP1_ADL_SB_ADP_S_DDR5_SODIMM_2DPC_LIB.H55_DG2_2DPC(SCH_1):PAGE411; CDS_LIB: discrete_2; VARIANT: ?; PCB Footprint: TK0_SM0201_690X390_MA; CHIPS_PART_NAME: CAP_2; CDS_PART_NAME: CAP_2_0201-C83410-045,EMPTY,1UF,10V,20%,TK0,GENERIC; CDS_LOCATION: C10176
C10177 = CAP_2: CDS_PHYS_PART_NAME: CAP_2_0201-C83410-045,EMPTY,1UF,10V,20%,TK0,GENERIC; CDS_LMAN_SYM_OUTLINE: -50,50,50,-50; FP_TECH: TK0; IP: GENERIC; ROOM: NONE; OriginalSymbolOrigin: (-50,25); XY: (-4850,2850); VER: 1; ROT: 0; PHYS_PAGE: 240; LOCATION: C10177; DRAWING: @RVP1_ADL_SB_ADP_S_DDR5_SODIMM_2DPC_LIB.H55_DG2_2DPC(SCH_1):PAGE411; CDS_LIB: discrete_2; VARIANT: ?; PCB Footprint: TK0_SM0201_690X390_MA; CHIPS_PART_NAME: CAP_2; CDS_PART_NAME: CAP_2_0201-C83410-045,EMPTY,1UF,10V,20%,TK0,GENERIC; CDS_LOCATION: C10177
C10182 = CAP_2: CDS_PHYS_PART_NAME: CAP_2_0201-C83410-045,EMPTY,1UF,10V,20%,TK0,GENERIC; CDS_LMAN_SYM_OUTLINE: -50,50,50,-50; FP_TECH: TK0; IP: GENERIC; ROOM: NONE; OriginalSymbolOrigin: (-50,25); XY: (-4450,3825); VER: 1; ROT: 0; PHYS_PAGE: 240; LOCATION: C10182; DRAWING: @RVP1_ADL_SB_ADP_S_DDR5_SODIMM_2DPC_LIB.H55_DG2_2DPC(SCH_1):PAGE411; CDS_LIB: discrete_2; VARIANT: ?; PCB Footprint: TK0_SM0201_690X390_MA; CHIPS_PART_NAME: CAP_2; CDS_PART_NAME: CAP_2_0201-C83410-045,EMPTY,1UF,10V,20%,TK0,GENERIC; CDS_LOCATION: C10182
C10185 = CAP_2: CDS_PHYS_PART_NAME: CAP_2_0201-C83410-045,EMPTY,1UF,10V,20%,TK0,GENERIC; CDS_LMAN_SYM_OUTLINE: -50,50,50,-50; FP_TECH: TK0; IP: GENERIC; ROOM: NONE; OriginalSymbolOrigin: (-50,25); XY: (-4400,2850); VER: 1; ROT: 0; PHYS_PAGE: 240; LOCATION: C10185; DRAWING: @RVP1_ADL_SB_ADP_S_DDR5_SODIMM_2DPC_LIB.H55_DG2_2DPC(SCH_1):PAGE411; CDS_LIB: discrete_2; VARIANT: ?; PCB Footprint: TK0_SM0201_690X390_MA; CHIPS_PART_NAME: CAP_2; CDS_PART_NAME: CAP_2_0201-C83410-045,EMPTY,1UF,10V,20%,TK0,GENERIC; CDS_LOCATION: C10185
C10189 = CAP_2: CDS_PHYS_PART_NAME: CAP_2_0201-C83410-045,EMPTY,1UF,10V,20%,TK0,GENERIC; CDS_LMAN_SYM_OUTLINE: -50,50,50,-50; FP_TECH: TK0; IP: GENERIC; ROOM: NONE; OriginalSymbolOrigin: (-50,25); XY: (-4000,3825); VER: 1; ROT: 0; PHYS_PAGE: 240; LOCATION: C10189; DRAWING: @RVP1_ADL_SB_ADP_S_DDR5_SODIMM_2DPC_LIB.H55_DG2_2DPC(SCH_1):PAGE411; CDS_LIB: discrete_2; VARIANT: ?; PCB Footprint: TK0_SM0201_690X390_MA; CHIPS_PART_NAME: CAP_2; CDS_PART_NAME: CAP_2_0201-C83410-045,EMPTY,1UF,10V,20%,TK0,GENERIC; CDS_LOCATION: C10189
C10194 = CAP_2: CDS_PHYS_PART_NAME: CAP_2_0201-C83410-045,EMPTY,1UF,10V,20%,TK0,GENERIC; CDS_LMAN_SYM_OUTLINE: -50,50,50,-50; FP_TECH: TK0; IP: GENERIC; ROOM: NONE; OriginalSymbolOrigin: (-50,25); XY: (-3950,2850); VER: 1; ROT: 0; PHYS_PAGE: 240; LOCATION: C10194; DRAWING: @RVP1_ADL_SB_ADP_S_DDR5_SODIMM_2DPC_LIB.H55_DG2_2DPC(SCH_1):PAGE411; CDS_LIB: discrete_2; VARIANT: ?; PCB Footprint: TK0_SM0201_690X390_MA; CHIPS_PART_NAME: CAP_2; CDS_PART_NAME: CAP_2_0201-C83410-045,EMPTY,1UF,10V,20%,TK0,GENERIC; CDS_LOCATION: C10194
C10195 = CAP_2: CDS_PHYS_PART_NAME: CAP_2_0201-C83410-045,EMPTY,1UF,10V,20%,TK0,GENERIC; CDS_LMAN_SYM_OUTLINE: -50,50,50,-50; FP_TECH: TK0; IP: GENERIC; ROOM: NONE; OriginalSymbolOrigin: (-50,25); XY: (-3550,3800); VER: 1; ROT: 0; PHYS_PAGE: 240; LOCATION: C10195; DRAWING: @RVP1_ADL_SB_ADP_S_DDR5_SODIMM_2DPC_LIB.H55_DG2_2DPC(SCH_1):PAGE411; CDS_LIB: discrete_2; VARIANT: ?; PCB Footprint: TK0_SM0201_690X390_MA; CHIPS_PART_NAME: CAP_2; CDS_PART_NAME: CAP_2_0201-C83410-045,EMPTY,1UF,10V,20%,TK0,GENERIC; CDS_LOCATION: C10195
C10196 = CAP_2: CDS_PHYS_PART_NAME: CAP_2_0201-C83410-045,EMPTY,1UF,10V,20%,TK0,GENERIC; CDS_LMAN_SYM_OUTLINE: -50,50,50,-50; FP_TECH: TK0; IP: GENERIC; ROOM: NONE; OriginalSymbolOrigin: (-50,25); XY: (-3500,2850); VER: 1; ROT: 0; PHYS_PAGE: 240; LOCATION: C10196; DRAWING: @RVP1_ADL_SB_ADP_S_DDR5_SODIMM_2DPC_LIB.H55_DG2_2DPC(SCH_1):PAGE411; CDS_LIB: discrete_2; VARIANT: ?; PCB Footprint: TK0_SM0201_690X390_MA; CHIPS_PART_NAME: CAP_2; CDS_PART_NAME: CAP_2_0201-C83410-045,EMPTY,1UF,10V,20%,TK0,GENERIC; CDS_LOCATION: C10196
C10197 = CAP_2: CDS_PHYS_PART_NAME: CAP_2_0201-C83410-045,EMPTY,1UF,10V,20%,TK0,GENERIC; CDS_LMAN_SYM_OUTLINE: -50,50,50,-50; FP_TECH: TK0; IP: GENERIC; ROOM: NONE; OriginalSymbolOrigin: (-50,25); XY: (-3100,3825); VER: 1; ROT: 0; PHYS_PAGE: 240; LOCATION: C10197; DRAWING: @RVP1_ADL_SB_ADP_S_DDR5_SODIMM_2DPC_LIB.H55_DG2_2DPC(SCH_1):PAGE411; CDS_LIB: discrete_2; VARIANT: ?; PCB Footprint: TK0_SM0201_690X390_MA; CHIPS_PART_NAME: CAP_2; CDS_PART_NAME: CAP_2_0201-C83410-045,EMPTY,1UF,10V,20%,TK0,GENERIC; CDS_LOCATION: C10197
C10204 = CAP_2: CDS_PHYS_PART_NAME: CAP_2_0201-C83410-045,EMPTY,1UF,10V,20%,TK0,GENERIC; CDS_LMAN_SYM_OUTLINE: -50,50,50,-50; FP_TECH: TK0; IP: GENERIC; ROOM: NONE; OriginalSymbolOrigin: (-50,25); XY: (-3050,2850); VER: 1; ROT: 0; PHYS_PAGE: 240; LOCATION: C10204; DRAWING: @RVP1_ADL_SB_ADP_S_DDR5_SODIMM_2DPC_LIB.H55_DG2_2DPC(SCH_1):PAGE411; CDS_LIB: discrete_2; VARIANT: ?; PCB Footprint: TK0_SM0201_690X390_MA; CHIPS_PART_NAME: CAP_2; CDS_PART_NAME: CAP_2_0201-C83410-045,EMPTY,1UF,10V,20%,TK0,GENERIC; CDS_LOCATION: C10204
C10209 = CAP_2: CDS_PHYS_PART_NAME: CAP_2_0201-C83410-045,EMPTY,1UF,10V,20%,TK0,GENERIC; CDS_LMAN_SYM_OUTLINE: -50,50,50,-50; FP_TECH: TK0; IP: GENERIC; ROOM: NONE; OriginalSymbolOrigin: (-50,25); XY: (-2650,3825); VER: 1; ROT: 0; PHYS_PAGE: 240; LOCATION: C10209; DRAWING: @RVP1_ADL_SB_ADP_S_DDR5_SODIMM_2DPC_LIB.H55_DG2_2DPC(SCH_1):PAGE411; CDS_LIB: discrete_2; VARIANT: ?; PCB Footprint: TK0_SM0201_690X390_MA; CHIPS_PART_NAME: CAP_2; CDS_PART_NAME: CAP_2_0201-C83410-045,EMPTY,1UF,10V,20%,TK0,GENERIC; CDS_LOCATION: C10209
C10212 = CAP_2: CDS_PHYS_PART_NAME: CAP_2_0201-C83410-045,EMPTY,1UF,10V,20%,TK0,GENERIC; CDS_LMAN_SYM_OUTLINE: -50,50,50,-50; FP_TECH: TK0; IP: GENERIC; ROOM: NONE; OriginalSymbolOrigin: (-50,25); XY: (-2600,2875); VER: 1; ROT: 0; PHYS_PAGE: 240; LOCATION: C10212; DRAWING: @RVP1_ADL_SB_ADP_S_DDR5_SODIMM_2DPC_LIB.H55_DG2_2DPC(SCH_1):PAGE411; CDS_LIB: discrete_2; VARIANT: ?; PCB Footprint: TK0_SM0201_690X390_MA; CHIPS_PART_NAME: CAP_2; CDS_PART_NAME: CAP_2_0201-C83410-045,EMPTY,1UF,10V,20%,TK0,GENERIC; CDS_LOCATION: C10212
C24001 = CAP: CDS_PHYS_PART_NAME: CAP_0201-C83410-014,X5R,0.1UF,10V,10%,LPDB,GENERIC; OriginalSymbolOrigin: (-50,25); XY: (-7550,1825); VER: 1; ROT: 0; PHYS_PAGE: 240; LOCATION: C24001; IP: GENERIC; FP_TECH: LPDB; DRAWING: @RVP1_ADL_SB_ADP_S_DDR5_SODIMM_2DPC_LIB.H55_DG2_2DPC(SCH_1):PAGE411; CDS_LIB: discrete; PCB Footprint: SMC0201IA; CHIPS_PART_NAME: CAP; CDS_PART_NAME: CAP_0201-C83410-014,X5R,0.1UF,10V,10%,LPDB,GENERIC; CDS_LOCATION: C24001
C24002 = CAP: CDS_PHYS_PART_NAME: CAP_0201-C83410-014,X5R,0.1UF,10V,10%,LPDB,GENERIC; OriginalSymbolOrigin: (-50,25); XY: (-7150,1825); VER: 1; ROT: 0; PHYS_PAGE: 240; LOCATION: C24002; IP: GENERIC; FP_TECH: LPDB; DRAWING: @RVP1_ADL_SB_ADP_S_DDR5_SODIMM_2DPC_LIB.H55_DG2_2DPC(SCH_1):PAGE411; CDS_LIB: discrete; PCB Footprint: SMC0201IA; CHIPS_PART_NAME: CAP; CDS_PART_NAME: CAP_0201-C83410-014,X5R,0.1UF,10V,10%,LPDB,GENERIC; CDS_LOCATION: C24002
C24003 = CAP: CDS_PHYS_PART_NAME: CAP_0201-C83410-014,X5R,0.1UF,10V,10%,LPDB,GENERIC; OriginalSymbolOrigin: (-50,25); XY: (-6700,1825); VER: 1; ROT: 0; PHYS_PAGE: 240; LOCATION: C24003; IP: GENERIC; FP_TECH: LPDB; DRAWING: @RVP1_ADL_SB_ADP_S_DDR5_SODIMM_2DPC_LIB.H55_DG2_2DPC(SCH_1):PAGE411; CDS_LIB: discrete; PCB Footprint: SMC0201IA; CHIPS_PART_NAME: CAP; CDS_PART_NAME: CAP_0201-C83410-014,X5R,0.1UF,10V,10%,LPDB,GENERIC; CDS_LOCATION: C24003
C24004 = CAP: CDS_PHYS_PART_NAME: CAP_0201-C83410-014,X5R,0.1UF,10V,10%,LPDB,GENERIC; OriginalSymbolOrigin: (-50,25); XY: (-6300,1825); VER: 1; ROT: 0; PHYS_PAGE: 240; LOCATION: C24004; IP: GENERIC; FP_TECH: LPDB; DRAWING: @RVP1_ADL_SB_ADP_S_DDR5_SODIMM_2DPC_LIB.H55_DG2_2DPC(SCH_1):PAGE411; CDS_LIB: discrete; PCB Footprint: SMC0201IA; CHIPS_PART_NAME: CAP; CDS_PART_NAME: CAP_0201-C83410-014,X5R,0.1UF,10V,10%,LPDB,GENERIC; CDS_LOCATION: C24004
C24005 = CAP: CDS_PHYS_PART_NAME: CAP_0201-C83410-014,X5R,0.1UF,10V,10%,LPDB,GENERIC; OriginalSymbolOrigin: (-50,25); XY: (-5875,1825); VER: 1; ROT: 0; PHYS_PAGE: 240; LOCATION: C24005; IP: GENERIC; FP_TECH: LPDB; DRAWING: @RVP1_ADL_SB_ADP_S_DDR5_SODIMM_2DPC_LIB.H55_DG2_2DPC(SCH_1):PAGE411; CDS_LIB: discrete; PCB Footprint: SMC0201IA; CHIPS_PART_NAME: CAP; CDS_PART_NAME: CAP_0201-C83410-014,X5R,0.1UF,10V,10%,LPDB,GENERIC; CDS_LOCATION: C24005
C24006 = CAP: CDS_PHYS_PART_NAME: CAP_0201-C83410-014,X5R,0.1UF,10V,10%,LPDB,GENERIC; OriginalSymbolOrigin: (-50,25); XY: (-5475,1825); VER: 1; ROT: 0; PHYS_PAGE: 240; LOCATION: C24006; IP: GENERIC; FP_TECH: LPDB; DRAWING: @RVP1_ADL_SB_ADP_S_DDR5_SODIMM_2DPC_LIB.H55_DG2_2DPC(SCH_1):PAGE411; CDS_LIB: discrete; PCB Footprint: SMC0201IA; CHIPS_PART_NAME: CAP; CDS_PART_NAME: CAP_0201-C83410-014,X5R,0.1UF,10V,10%,LPDB,GENERIC; CDS_LOCATION: C24006
C24007 = CAP: CDS_PHYS_PART_NAME: CAP_0201-C83410-014,X5R,0.1UF,10V,10%,LPDB,GENERIC; OriginalSymbolOrigin: (-50,25); XY: (-5025,1825); VER: 1; ROT: 0; PHYS_PAGE: 240; LOCATION: C24007; IP: GENERIC; FP_TECH: LPDB; DRAWING: @RVP1_ADL_SB_ADP_S_DDR5_SODIMM_2DPC_LIB.H55_DG2_2DPC(SCH_1):PAGE411; CDS_LIB: discrete; PCB Footprint: SMC0201IA; CHIPS_PART_NAME: CAP; CDS_PART_NAME: CAP_0201-C83410-014,X5R,0.1UF,10V,10%,LPDB,GENERIC; CDS_LOCATION: C24007
C24008 = CAP: CDS_PHYS_PART_NAME: CAP_0201-C83410-014,X5R,0.1UF,10V,10%,LPDB,GENERIC; OriginalSymbolOrigin: (-50,25); XY: (-4625,1825); VER: 1; ROT: 0; PHYS_PAGE: 240; LOCATION: C24008; IP: GENERIC; FP_TECH: LPDB; DRAWING: @RVP1_ADL_SB_ADP_S_DDR5_SODIMM_2DPC_LIB.H55_DG2_2DPC(SCH_1):PAGE411; CDS_LIB: discrete; PCB Footprint: SMC0201IA; CHIPS_PART_NAME: CAP; CDS_PART_NAME: CAP_0201-C83410-014,X5R,0.1UF,10V,10%,LPDB,GENERIC; CDS_LOCATION: C24008
C24009 = CAP: CDS_PHYS_PART_NAME: CAP_0201-C83410-014,X5R,0.1UF,10V,10%,LPDB,GENERIC; OriginalSymbolOrigin: (-50,25); XY: (-4225,1800); VER: 1; ROT: 0; PHYS_PAGE: 240; LOCATION: C24009; IP: GENERIC; FP_TECH: LPDB; DRAWING: @RVP1_ADL_SB_ADP_S_DDR5_SODIMM_2DPC_LIB.H55_DG2_2DPC(SCH_1):PAGE411; CDS_LIB: discrete; PCB Footprint: SMC0201IA; CHIPS_PART_NAME: CAP; CDS_PART_NAME: CAP_0201-C83410-014,X5R,0.1UF,10V,10%,LPDB,GENERIC; CDS_LOCATION: C24009
C24010 = CAP: CDS_PHYS_PART_NAME: CAP_0201-C83410-014,X5R,0.1UF,10V,10%,LPDB,GENERIC; OriginalSymbolOrigin: (-50,25); XY: (-3825,1800); VER: 1; ROT: 0; PHYS_PAGE: 240; LOCATION: C24010; IP: GENERIC; FP_TECH: LPDB; DRAWING: @RVP1_ADL_SB_ADP_S_DDR5_SODIMM_2DPC_LIB.H55_DG2_2DPC(SCH_1):PAGE411; CDS_LIB: discrete; PCB Footprint: SMC0201IA; CHIPS_PART_NAME: CAP; CDS_PART_NAME: CAP_0201-C83410-014,X5R,0.1UF,10V,10%,LPDB,GENERIC; CDS_LOCATION: C24010
C24011 = CAP: CDS_PHYS_PART_NAME: CAP_0201-C83410-014,X5R,0.1UF,10V,10%,LPDB,GENERIC; OriginalSymbolOrigin: (-50,25); XY: (-3375,1800); VER: 1; ROT: 0; PHYS_PAGE: 240; LOCATION: C24011; IP: GENERIC; FP_TECH: LPDB; DRAWING: @RVP1_ADL_SB_ADP_S_DDR5_SODIMM_2DPC_LIB.H55_DG2_2DPC(SCH_1):PAGE411; CDS_LIB: discrete; PCB Footprint: SMC0201IA; CHIPS_PART_NAME: CAP; CDS_PART_NAME: CAP_0201-C83410-014,X5R,0.1UF,10V,10%,LPDB,GENERIC; CDS_LOCATION: C24011
C24013 = CAP: CDS_PHYS_PART_NAME: CAP_0201-C83410-014,X5R,0.1UF,10V,10%,LPDB,GENERIC; OriginalSymbolOrigin: (-50,25); XY: (-2975,1800); VER: 1; ROT: 0; PHYS_PAGE: 240; LOCATION: C24013; IP: GENERIC; FP_TECH: LPDB; DRAWING: @RVP1_ADL_SB_ADP_S_DDR5_SODIMM_2DPC_LIB.H55_DG2_2DPC(SCH_1):PAGE411; CDS_LIB: discrete; PCB Footprint: SMC0201IA; CHIPS_PART_NAME: CAP; CDS_PART_NAME: CAP_0201-C83410-014,X5R,0.1UF,10V,10%,LPDB,GENERIC; CDS_LOCATION: C24013
C24014 = CAP: CDS_PHYS_PART_NAME: CAP_0201-C83410-014,X5R,0.1UF,10V,10%,LPDB,GENERIC; OriginalSymbolOrigin: (-50,25); XY: (-2550,1800); VER: 1; ROT: 0; PHYS_PAGE: 240; LOCATION: C24014; IP: GENERIC; FP_TECH: LPDB; DRAWING: @RVP1_ADL_SB_ADP_S_DDR5_SODIMM_2DPC_LIB.H55_DG2_2DPC(SCH_1):PAGE411; CDS_LIB: discrete; PCB Footprint: SMC0201IA; CHIPS_PART_NAME: CAP; CDS_PART_NAME: CAP_0201-C83410-014,X5R,0.1UF,10V,10%,LPDB,GENERIC; CDS_LOCATION: C24014
C24015 = CAP: CDS_PHYS_PART_NAME: CAP_0201-C83410-014,X5R,0.1UF,10V,10%,LPDB,GENERIC; OriginalSymbolOrigin: (-50,25); XY: (-2150,1800); VER: 1; ROT: 0; PHYS_PAGE: 240; LOCATION: C24015; IP: GENERIC; FP_TECH: LPDB; DRAWING: @RVP1_ADL_SB_ADP_S_DDR5_SODIMM_2DPC_LIB.H55_DG2_2DPC(SCH_1):PAGE411; CDS_LIB: discrete; PCB Footprint: SMC0201IA; CHIPS_PART_NAME: CAP; CDS_PART_NAME: CAP_0201-C83410-014,X5R,0.1UF,10V,10%,LPDB,GENERIC; CDS_LOCATION: C24015
C24016 = CAP: CDS_PHYS_PART_NAME: CAP_0201-C83410-014,X5R,0.1UF,10V,10%,LPDB,GENERIC; OriginalSymbolOrigin: (-50,25); XY: (-1700,1800); VER: 1; ROT: 0; PHYS_PAGE: 240; LOCATION: C24016; IP: GENERIC; FP_TECH: LPDB; DRAWING: @RVP1_ADL_SB_ADP_S_DDR5_SODIMM_2DPC_LIB.H55_DG2_2DPC(SCH_1):PAGE411; CDS_LIB: discrete; PCB Footprint: SMC0201IA; CHIPS_PART_NAME: CAP; CDS_PART_NAME: CAP_0201-C83410-014,X5R,0.1UF,10V,10%,LPDB,GENERIC; CDS_LOCATION: C24016
C24017 = CAP: CDS_PHYS_PART_NAME: CAP_0201-C83410-014,X5R,0.1UF,10V,10%,LPDB,GENERIC; OriginalSymbolOrigin: (-50,25); XY: (-1300,1800); VER: 1; ROT: 0; PHYS_PAGE: 240; LOCATION: C24017; IP: GENERIC; FP_TECH: LPDB; DRAWING: @RVP1_ADL_SB_ADP_S_DDR5_SODIMM_2DPC_LIB.H55_DG2_2DPC(SCH_1):PAGE411; CDS_LIB: discrete; PCB Footprint: SMC0201IA; CHIPS_PART_NAME: CAP; CDS_PART_NAME: CAP_0201-C83410-014,X5R,0.1UF,10V,10%,LPDB,GENERIC; CDS_LOCATION: C24017
C24018 = CAP: CDS_PHYS_PART_NAME: CAP_0201-C83410-014,X5R,0.1UF,10V,10%,LPDB,GENERIC; OriginalSymbolOrigin: (-50,25); XY: (-7500,900); VER: 1; ROT: 0; PHYS_PAGE: 240; LOCATION: C24018; IP: GENERIC; FP_TECH: LPDB; DRAWING: @RVP1_ADL_SB_ADP_S_DDR5_SODIMM_2DPC_LIB.H55_DG2_2DPC(SCH_1):PAGE411; CDS_LIB: discrete; PCB Footprint: SMC0201IA; CHIPS_PART_NAME: CAP; CDS_PART_NAME: CAP_0201-C83410-014,X5R,0.1UF,10V,10%,LPDB,GENERIC; CDS_LOCATION: C24018
C24019 = CAP: CDS_PHYS_PART_NAME: CAP_0201-C83410-014,X5R,0.1UF,10V,10%,LPDB,GENERIC; OriginalSymbolOrigin: (-50,25); XY: (-7100,900); VER: 1; ROT: 0; PHYS_PAGE: 240; LOCATION: C24019; IP: GENERIC; FP_TECH: LPDB; DRAWING: @RVP1_ADL_SB_ADP_S_DDR5_SODIMM_2DPC_LIB.H55_DG2_2DPC(SCH_1):PAGE411; CDS_LIB: discrete; PCB Footprint: SMC0201IA; CHIPS_PART_NAME: CAP; CDS_PART_NAME: CAP_0201-C83410-014,X5R,0.1UF,10V,10%,LPDB,GENERIC; CDS_LOCATION: C24019
C24020 = CAP: CDS_PHYS_PART_NAME: CAP_0201-C83410-014,X5R,0.1UF,10V,10%,LPDB,GENERIC; OriginalSymbolOrigin: (-50,25); XY: (-6650,900); VER: 1; ROT: 0; PHYS_PAGE: 240; LOCATION: C24020; IP: GENERIC; FP_TECH: LPDB; DRAWING: @RVP1_ADL_SB_ADP_S_DDR5_SODIMM_2DPC_LIB.H55_DG2_2DPC(SCH_1):PAGE411; CDS_LIB: discrete; PCB Footprint: SMC0201IA; CHIPS_PART_NAME: CAP; CDS_PART_NAME: CAP_0201-C83410-014,X5R,0.1UF,10V,10%,LPDB,GENERIC; CDS_LOCATION: C24020
C24021 = CAP: CDS_PHYS_PART_NAME: CAP_0201-C83410-014,X5R,0.1UF,10V,10%,LPDB,GENERIC; OriginalSymbolOrigin: (-50,25); XY: (-6250,900); VER: 1; ROT: 0; PHYS_PAGE: 240; LOCATION: C24021; IP: GENERIC; FP_TECH: LPDB; DRAWING: @RVP1_ADL_SB_ADP_S_DDR5_SODIMM_2DPC_LIB.H55_DG2_2DPC(SCH_1):PAGE411; CDS_LIB: discrete; PCB Footprint: SMC0201IA; CHIPS_PART_NAME: CAP; CDS_PART_NAME: CAP_0201-C83410-014,X5R,0.1UF,10V,10%,LPDB,GENERIC; CDS_LOCATION: C24021
C24023 = CAP: CDS_PHYS_PART_NAME: CAP_0201-C83410-014,X5R,0.1UF,10V,10%,LPDB,GENERIC; OriginalSymbolOrigin: (-50,25); XY: (-5825,900); VER: 1; ROT: 0; PHYS_PAGE: 240; LOCATION: C24023; IP: GENERIC; FP_TECH: LPDB; DRAWING: @RVP1_ADL_SB_ADP_S_DDR5_SODIMM_2DPC_LIB.H55_DG2_2DPC(SCH_1):PAGE411; CDS_LIB: discrete; PCB Footprint: SMC0201IA; CHIPS_PART_NAME: CAP; CDS_PART_NAME: CAP_0201-C83410-014,X5R,0.1UF,10V,10%,LPDB,GENERIC; CDS_LOCATION: C24023
C24024 = CAP: CDS_PHYS_PART_NAME: CAP_0201-C83410-014,X5R,0.1UF,10V,10%,LPDB,GENERIC; OriginalSymbolOrigin: (-50,25); XY: (-5425,900); VER: 1; ROT: 0; PHYS_PAGE: 240; LOCATION: C24024; IP: GENERIC; FP_TECH: LPDB; DRAWING: @RVP1_ADL_SB_ADP_S_DDR5_SODIMM_2DPC_LIB.H55_DG2_2DPC(SCH_1):PAGE411; CDS_LIB: discrete; PCB Footprint: SMC0201IA; CHIPS_PART_NAME: CAP; CDS_PART_NAME: CAP_0201-C83410-014,X5R,0.1UF,10V,10%,LPDB,GENERIC; CDS_LOCATION: C24024
C24025 = CAP: CDS_PHYS_PART_NAME: CAP_0201-C83410-014,X5R,0.1UF,10V,10%,LPDB,GENERIC; OriginalSymbolOrigin: (-50,25); XY: (-4975,900); VER: 1; ROT: 0; PHYS_PAGE: 240; LOCATION: C24025; IP: GENERIC; FP_TECH: LPDB; DRAWING: @RVP1_ADL_SB_ADP_S_DDR5_SODIMM_2DPC_LIB.H55_DG2_2DPC(SCH_1):PAGE411; CDS_LIB: discrete; PCB Footprint: SMC0201IA; CHIPS_PART_NAME: CAP; CDS_PART_NAME: CAP_0201-C83410-014,X5R,0.1UF,10V,10%,LPDB,GENERIC; CDS_LOCATION: C24025
C24026 = CAP: CDS_PHYS_PART_NAME: CAP_0201-C83410-014,X5R,0.1UF,10V,10%,LPDB,GENERIC; OriginalSymbolOrigin: (-50,25); XY: (-4575,900); VER: 1; ROT: 0; PHYS_PAGE: 240; LOCATION: C24026; IP: GENERIC; FP_TECH: LPDB; DRAWING: @RVP1_ADL_SB_ADP_S_DDR5_SODIMM_2DPC_LIB.H55_DG2_2DPC(SCH_1):PAGE411; CDS_LIB: discrete; PCB Footprint: SMC0201IA; CHIPS_PART_NAME: CAP; CDS_PART_NAME: CAP_0201-C83410-014,X5R,0.1UF,10V,10%,LPDB,GENERIC; CDS_LOCATION: C24026
C24027 = CAP: CDS_PHYS_PART_NAME: CAP_0201-C83410-014,X5R,0.1UF,10V,10%,LPDB,GENERIC; OriginalSymbolOrigin: (-50,25); XY: (-4175,875); VER: 1; ROT: 0; PHYS_PAGE: 240; LOCATION: C24027; IP: GENERIC; FP_TECH: LPDB; DRAWING: @RVP1_ADL_SB_ADP_S_DDR5_SODIMM_2DPC_LIB.H55_DG2_2DPC(SCH_1):PAGE411; CDS_LIB: discrete; PCB Footprint: SMC0201IA; CHIPS_PART_NAME: CAP; CDS_PART_NAME: CAP_0201-C83410-014,X5R,0.1UF,10V,10%,LPDB,GENERIC; CDS_LOCATION: C24027
C24028 = CAP: CDS_PHYS_PART_NAME: CAP_0201-C83410-014,X5R,0.1UF,10V,10%,LPDB,GENERIC; OriginalSymbolOrigin: (-50,25); XY: (-3775,875); VER: 1; ROT: 0; PHYS_PAGE: 240; LOCATION: C24028; IP: GENERIC; FP_TECH: LPDB; DRAWING: @RVP1_ADL_SB_ADP_S_DDR5_SODIMM_2DPC_LIB.H55_DG2_2DPC(SCH_1):PAGE411; CDS_LIB: discrete; PCB Footprint: SMC0201IA; CHIPS_PART_NAME: CAP; CDS_PART_NAME: CAP_0201-C83410-014,X5R,0.1UF,10V,10%,LPDB,GENERIC; CDS_LOCATION: C24028
C24029 = CAP: CDS_PHYS_PART_NAME: CAP_0201-C83410-014,X5R,0.1UF,10V,10%,LPDB,GENERIC; OriginalSymbolOrigin: (-50,25); XY: (-3325,875); VER: 1; ROT: 0; PHYS_PAGE: 240; LOCATION: C24029; IP: GENERIC; FP_TECH: LPDB; DRAWING: @RVP1_ADL_SB_ADP_S_DDR5_SODIMM_2DPC_LIB.H55_DG2_2DPC(SCH_1):PAGE411; CDS_LIB: discrete; PCB Footprint: SMC0201IA; CHIPS_PART_NAME: CAP; CDS_PART_NAME: CAP_0201-C83410-014,X5R,0.1UF,10V,10%,LPDB,GENERIC; CDS_LOCATION: C24029
C24030 = CAP: CDS_PHYS_PART_NAME: CAP_0201-C83410-014,X5R,0.1UF,10V,10%,LPDB,GENERIC; OriginalSymbolOrigin: (-50,25); XY: (-2925,875); VER: 1; ROT: 0; PHYS_PAGE: 240; LOCATION: C24030; IP: GENERIC; FP_TECH: LPDB; DRAWING: @RVP1_ADL_SB_ADP_S_DDR5_SODIMM_2DPC_LIB.H55_DG2_2DPC(SCH_1):PAGE411; CDS_LIB: discrete; PCB Footprint: SMC0201IA; CHIPS_PART_NAME: CAP; CDS_PART_NAME: CAP_0201-C83410-014,X5R,0.1UF,10V,10%,LPDB,GENERIC; CDS_LOCATION: C24030
C24031 = CAP: CDS_PHYS_PART_NAME: CAP_0201-C83410-014,X5R,0.1UF,10V,10%,LPDB,GENERIC; OriginalSymbolOrigin: (-50,25); XY: (-2500,875); VER: 1; ROT: 0; PHYS_PAGE: 240; LOCATION: C24031; IP: GENERIC; FP_TECH: LPDB; DRAWING: @RVP1_ADL_SB_ADP_S_DDR5_SODIMM_2DPC_LIB.H55_DG2_2DPC(SCH_1):PAGE411; CDS_LIB: discrete; PCB Footprint: SMC0201IA; CHIPS_PART_NAME: CAP; CDS_PART_NAME: CAP_0201-C83410-014,X5R,0.1UF,10V,10%,LPDB,GENERIC; CDS_LOCATION: C24031
C24034 = CAP: CDS_PHYS_PART_NAME: CAP_0201-C83410-014,X5R,0.1UF,10V,10%,LPDB,GENERIC; OriginalSymbolOrigin: (-50,25); XY: (-2100,875); VER: 1; ROT: 0; PHYS_PAGE: 240; LOCATION: C24034; IP: GENERIC; FP_TECH: LPDB; DRAWING: @RVP1_ADL_SB_ADP_S_DDR5_SODIMM_2DPC_LIB.H55_DG2_2DPC(SCH_1):PAGE411; CDS_LIB: discrete; PCB Footprint: SMC0201IA; CHIPS_PART_NAME: CAP; CDS_PART_NAME: CAP_0201-C83410-014,X5R,0.1UF,10V,10%,LPDB,GENERIC; CDS_LOCATION: C24034
C24035 = CAP: CDS_PHYS_PART_NAME: CAP_0201-C83410-014,X5R,0.1UF,10V,10%,LPDB,GENERIC; OriginalSymbolOrigin: (-50,25); XY: (-1650,875); VER: 1; ROT: 0; PHYS_PAGE: 240; LOCATION: C24035; IP: GENERIC; FP_TECH: LPDB; DRAWING: @RVP1_ADL_SB_ADP_S_DDR5_SODIMM_2DPC_LIB.H55_DG2_2DPC(SCH_1):PAGE411; CDS_LIB: discrete; PCB Footprint: SMC0201IA; CHIPS_PART_NAME: CAP; CDS_PART_NAME: CAP_0201-C83410-014,X5R,0.1UF,10V,10%,LPDB,GENERIC; CDS_LOCATION: C24035
C24036 = CAP: CDS_PHYS_PART_NAME: CAP_0201-C83410-014,X5R,0.1UF,10V,10%,LPDB,GENERIC; OriginalSymbolOrigin: (-50,25); XY: (-1250,875); VER: 1; ROT: 0; PHYS_PAGE: 240; LOCATION: C24036; IP: GENERIC; FP_TECH: LPDB; DRAWING: @RVP1_ADL_SB_ADP_S_DDR5_SODIMM_2DPC_LIB.H55_DG2_2DPC(SCH_1):PAGE411; CDS_LIB: discrete; PCB Footprint: SMC0201IA; CHIPS_PART_NAME: CAP; CDS_PART_NAME: CAP_0201-C83410-014,X5R,0.1UF,10V,10%,LPDB,GENERIC; CDS_LOCATION: C24036